# EAGLE design BPC3010_Papilio_Pro (EAGLE 5.11)
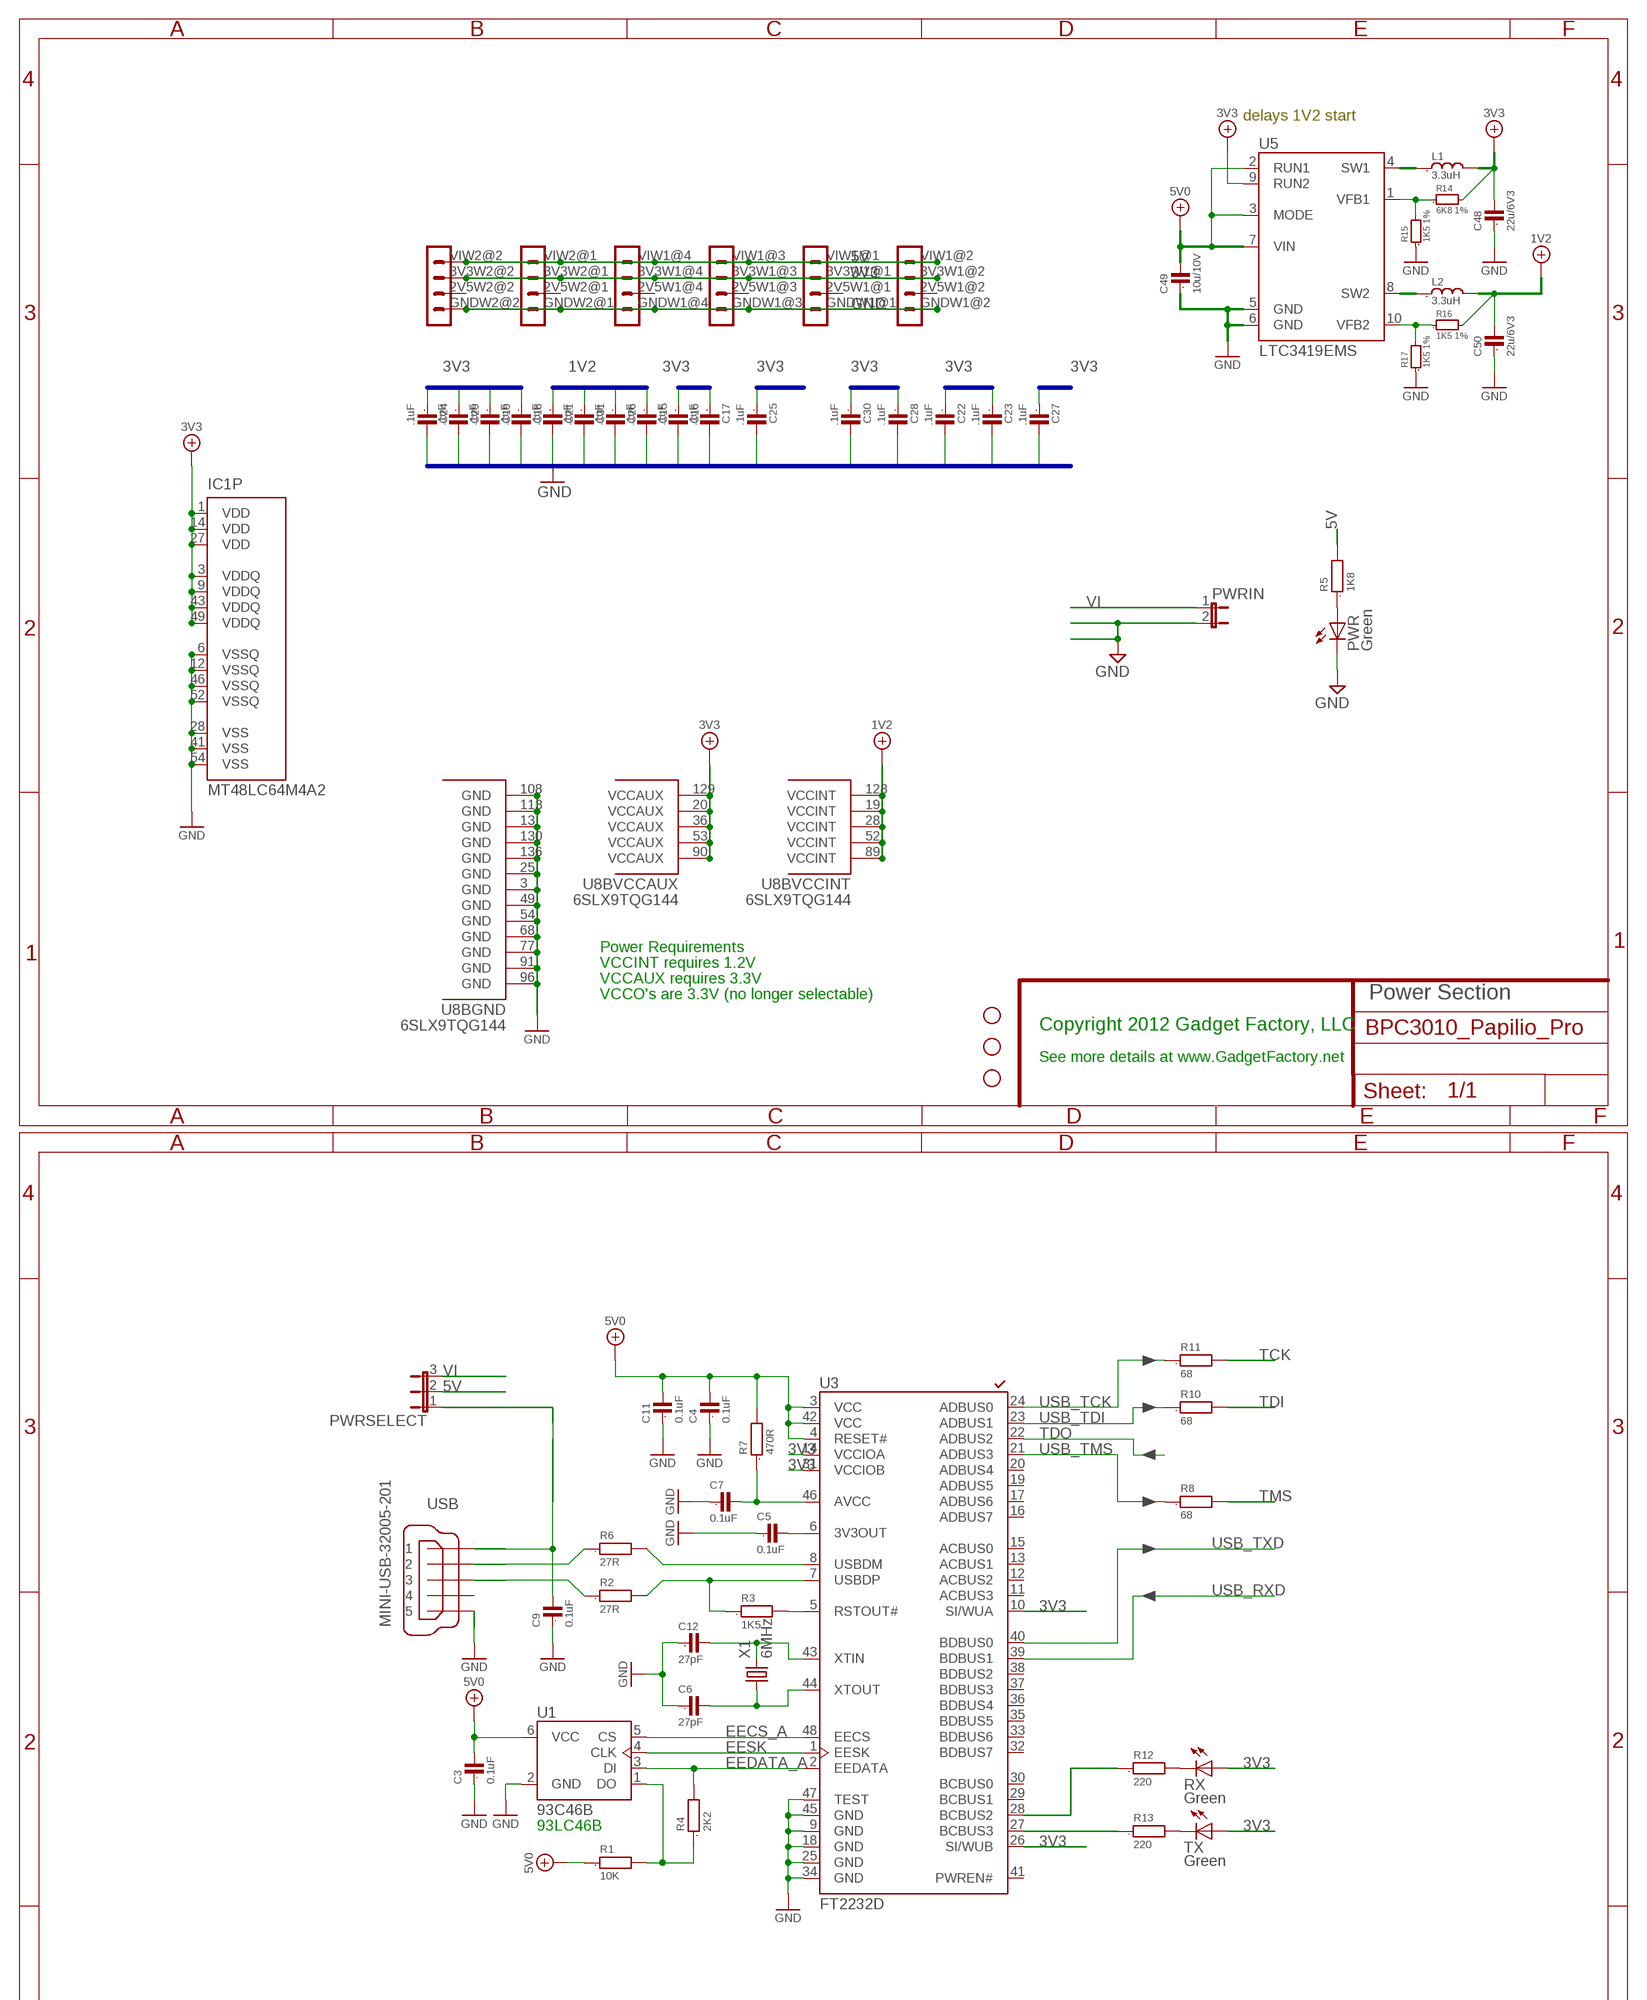
[diagram p0: schematic, sheet 1, part 1 of 2]
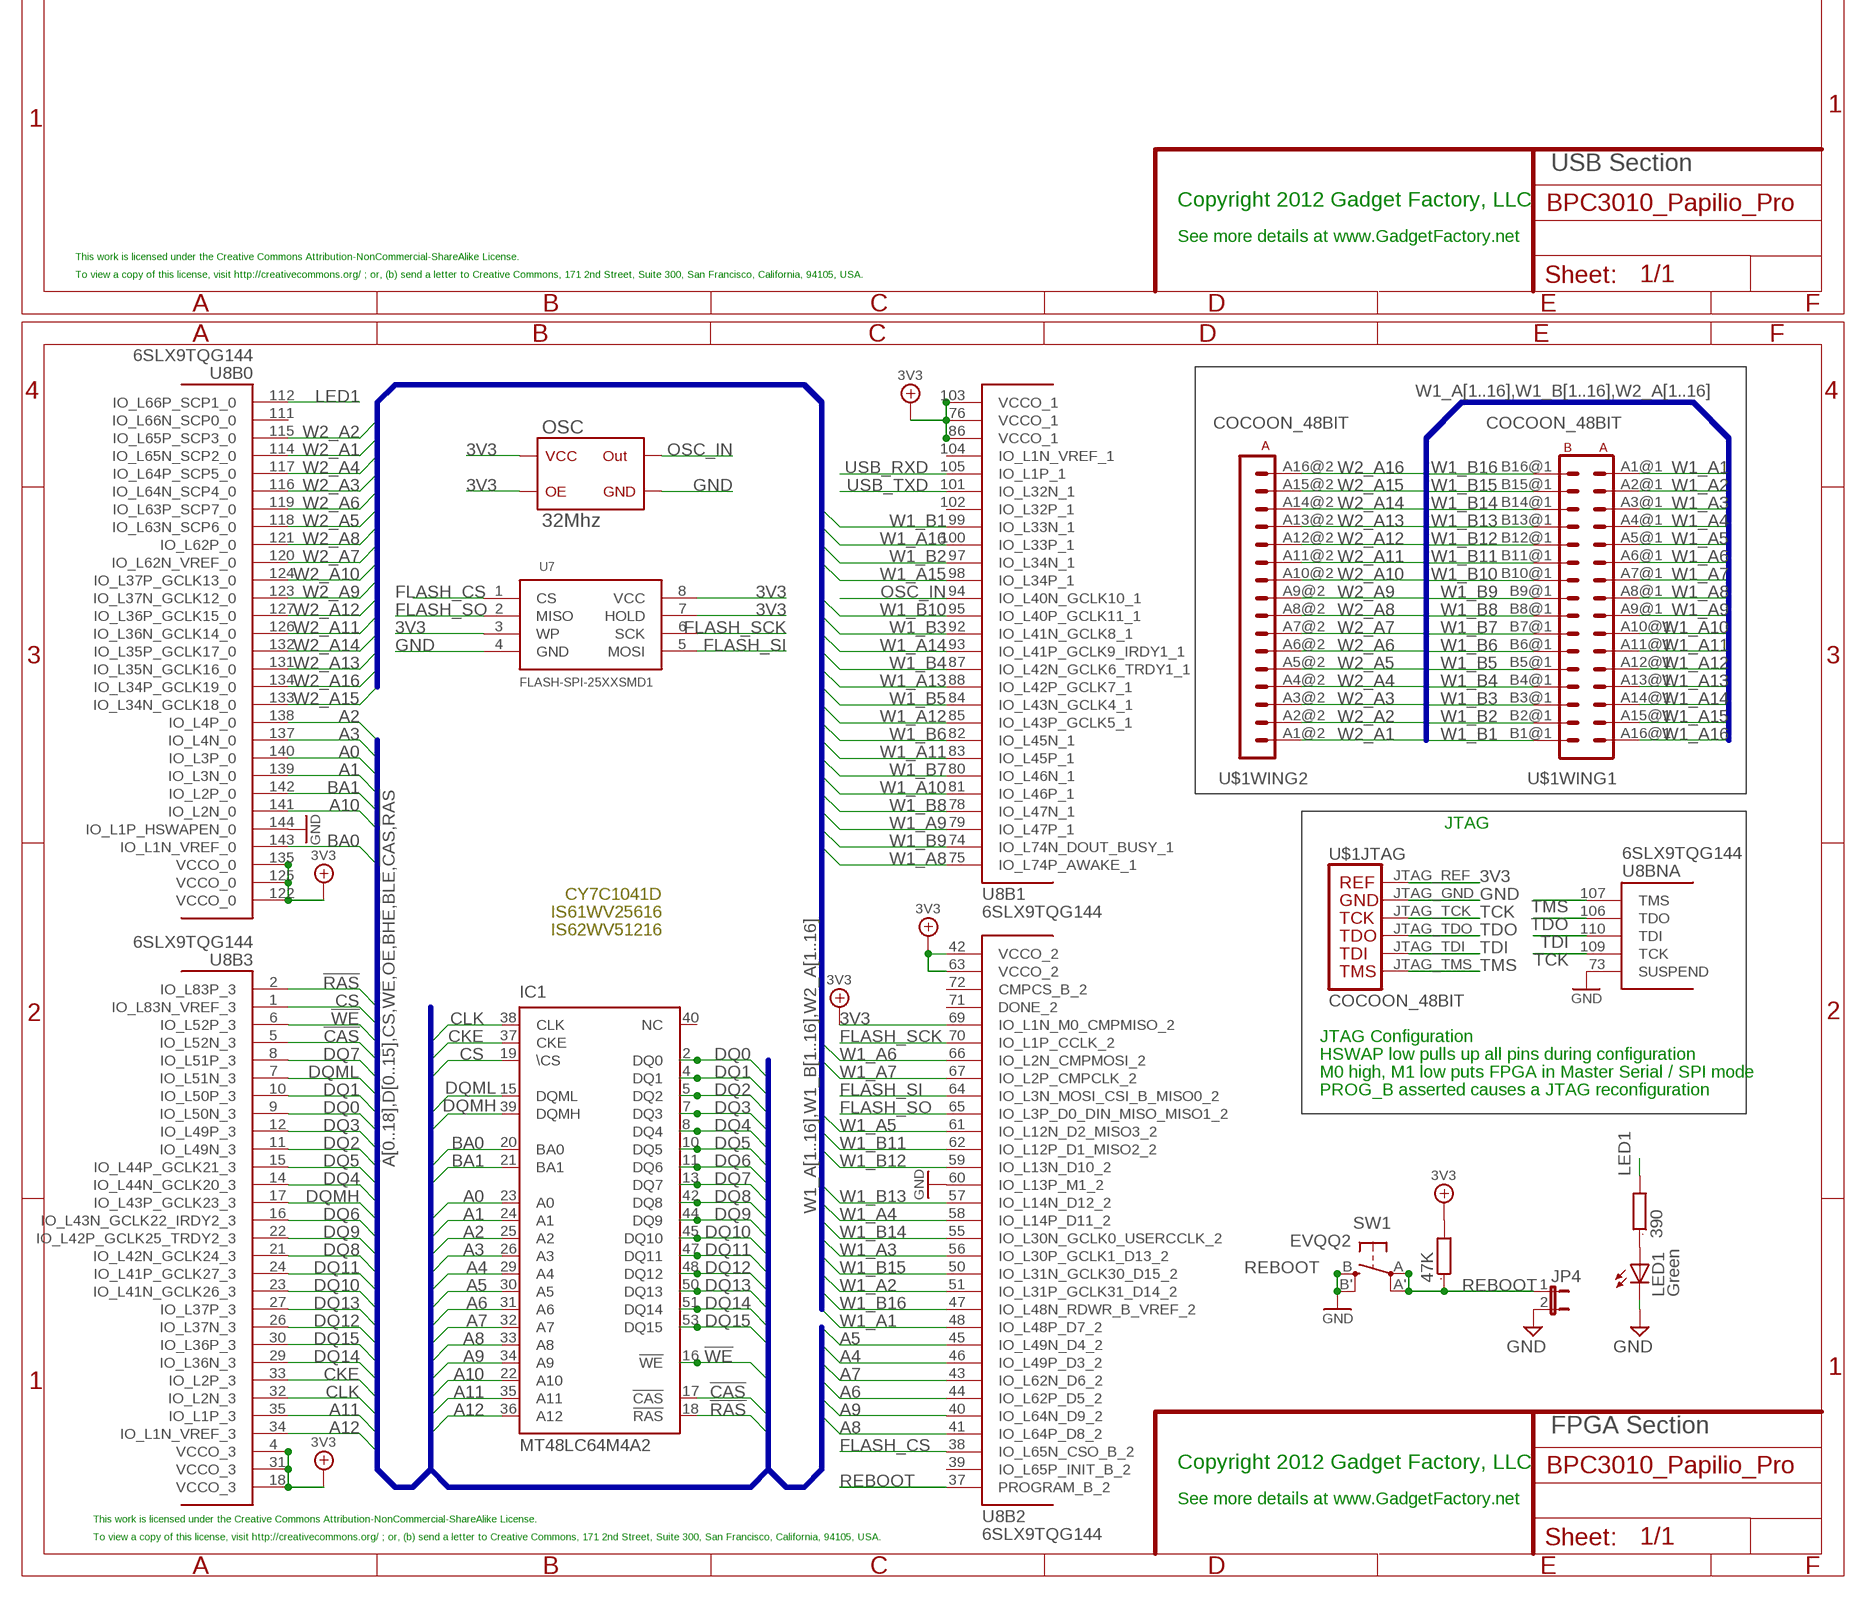
[diagram p1: schematic, sheet 1, part 2 of 2]

## Parts
C3  0.1uF  C0805  [0805]
C4  0.1uF  C0805  [0805]
C5  0.1uF  C0805  [0805]
C6  27pF  C0805  [0805]
C7  0.1uF  C0805  [0805]
C9  0.1uF  C0805  [0805]
C11  0.1uF  C0805  [0805]
C12  27pF  C0805  [0805]
C15  .1uF  C0603  [0603]
C16  .1uF  C0603  [0603]
C17  .1uF  C0603  [0603]
C18  .1uF  C0603  [0603]
C19  .1uF  C0603  [0603]
C21  .1uF  C0603  [0603]
C22  .1uF  C0603  [0603]
C23  .1uF  C0603  [0603]
C24  .1uF  C0603  [0603]
C25  .1uF  C0603  [0603]
C26  .1uF  C0603  [0603]
C27  .1uF  C0603  [0603]
C28  .1uF  C0603  [0603]
C29  .1uF  C0603  [0603]
C30  .1uF  C0603  [0603]
C31  .1uF  C0603  [0603]
C48  22u/6V3  C0805  [0805]
C49  10u/10V  C0805  [0805]
C50  22u/6V3  C0805  [0805]
IC1  MT48LC64M4A2  [TSOP54-400]
JP2  STAND-OFF  [STAND-OFF]
JP3  STAND-OFF  [STAND-OFF]
JP4  JP1E  [JP1]
JP5  STAND-OFF  [STAND-OFF]
L1  3.3uH  L_VLS3015  [VLS3015]
L2  3.3uH  L_VLS3015  [VLS3015]
LED1  Green  LEDCHIPLED_0805  [CHIPLED_0805]
OSC  32Mhz  OSC1  [OSC1]
PWR  Green  LEDCHIP-LED0805  [CHIP-LED0805]
PWRIN  JP1E  [JP1]
PWRSELECT  JP2E  [JP2]
R1  10K  R0805  [0805@1]
R2  27R  R0805  [0805@1]
R3  1K5  R0805  [0805@1]
R4  2K2  R0805  [0805@1]
R5  1K8  R0805  [0805]
R6  27R  R0805  [0805@1]
R7  470R  R0805  [0805@1]
R8  68  R0805  [0805]
R10  68  R0805  [0805]
R11  68  R0805  [0805]
R12  220  R0805  [0805]
R13  220  R0805  [0805]
R14  6K8 1%  R-SMALL0603  [0603]
R15  1K5 1%  R-SMALL0603  [0603]
R16  1K5 1%  R-SMALL0603  [0603]
R17  1K5 1%  R-SMALL0603  [0603]
R33  47K  R0805  [0805]
R37  390  R0805  [0805]
RX  Green  LEDCHIP-LED0805  [CHIP-LED0805]
SW1  EVQQ2  [EVQ-Q2]
TX  Green  LEDCHIP-LED0805  [CHIP-LED0805]
U1  93C46B  DIGITAL-EEPROM-MICROWIRE-6P_SOT23  [SOT23-6]
U3  FT2232D  [LQFP48]
U5  LTC3419EMS  [MSOP10]
U7  FLASH-SPI-25XXSMD1  [SO08-EIAJ]
U8  6SLX9TQG144  [TQ144]
U$1  COCOON_48BIT  [COCOON_48BIT]
USB  MINI-USB-32005-201  [32005-201]
X1  6MHz  CRYSTALHC49S  [HC49/S]

## Nets
1V2: C15.1 C21.1 C26.1 C31.1 C50.2 L2.2 R16.2 U8.19(BVCCINT:VCCINT) U8.28(BVCCINT:VCCINT) U8.52(BVCCINT:VCCINT) U8.89(BVCCINT:VCCINT) U8.128(BVCCINT:VCCINT)
3V3: C16.1 C17.1 C18.1 C19.1 C22.1 C23.1 C24.1 C25.1 C27.1 C28.1 C29.1 C30.1 C48.2 IC1.1(VDD) IC1.3(VDDQ) IC1.9(VDDQ) IC1.14(VDD) IC1.27(VDD) IC1.43(VDDQ) IC1.49(VDDQ) L1.2 OSC.1@1(OE) OSC.4@4(VCC) R14.2 R33.2 RX.A TX.A U3.10(SI/WUA) U3.14(VCCIOA) U3.26(SI/WUB) U3.31(VCCIOB) U5.9(RUN2) U7.3(WP) U7.7(HOLD) U7.8(VCC) U8.4(B3:VCCO_3) U8.18(B3:VCCO_3) U8.20(BVCCAUX:VCCAUX) U8.31(B3:VCCO_3) U8.36(BVCCAUX:VCCAUX) U8.42(B2:VCCO_2) U8.53(BVCCAUX:VCCAUX) U8.63(B2:VCCO_2) U8.69(B2:IO_L1N_M0_CMPMISO_2) U8.76(B1:VCCO_1) U8.86(B1:VCCO_1) U8.90(BVCCAUX:VCCAUX) U8.103(B1:VCCO_1) U8.122(B0:VCCO_0) U8.125(B0:VCCO_0) U8.129(BVCCAUX:VCCAUX) U8.135(B0:VCCO_0) U$1.3V3W1@1(3V3) U$1.3V3W1@2(3V3) U$1.3V3W1@3(3V3) U$1.3V3W1@4(3V3) U$1.3V3W2@1(3V3) U$1.3V3W2@2(3V3) U$1.JTAG_REF(JTAG:JTAG_REF)
3V3OUT_A: C5.2 U3.6(3V3OUT)
5V: C3.2 C4.2 C11.2 C49.2 PWRSELECT.2 R1.1 R5.2 R7.2 U1.6(VCC) U3.3(VCC) U3.4(RESET#) U3.42(VCC) U5.2(RUN1) U5.3(MODE) U5.7(VIN) U$1.VIW1@1(5V) U$1.VIW1@2(5V) U$1.VIW1@3(5V) U$1.VIW1@4(5V) U$1.VIW2@1(5V) U$1.VIW2@2(5V) ; supply symbol labelled 5V0
!CAS: IC1.17(!CAS) U8.5(B3:IO_L52N_3)
!RAS: IC1.18(!RAS) U8.2(B3:IO_L83P_3)
!WE: IC1.16(!WE) U8.6(B3:IO_L52P_3)
A0: IC1.23(A0) U8.140(B0:IO_L3P_0)
A1: IC1.24(A1) U8.139(B0:IO_L3N_0)
A2: IC1.25(A2) U8.138(B0:IO_L4P_0)
A3: IC1.26(A3) U8.137(B0:IO_L4N_0)
A4: IC1.29(A4) U8.46(B2:IO_L49P_D3_2)
A5: IC1.30(A5) U8.45(B2:IO_L49N_D4_2)
A6: IC1.31(A6) U8.44(B2:IO_L62P_D5_2)
A7: IC1.32(A7) U8.43(B2:IO_L62N_D6_2)
A8: IC1.33(A8) U8.41(B2:IO_L64P_D8_2)
A9: IC1.34(A9) U8.40(B2:IO_L64N_D9_2)
A10: IC1.22(A10) U8.141(B0:IO_L2N_0)
A11: IC1.35(A11) U8.35(B3:IO_L1P_3)
A12: IC1.36(A12) U8.34(B3:IO_L1N_VREF_3)
BA0: IC1.20(BA0) U8.143(B0:IO_L1N_VREF_0)
BA1: IC1.21(BA1) U8.142(B0:IO_L2P_0)
CKE: IC1.37(CKE) U8.33(B3:IO_L2P_3)
CLK: IC1.38(CLK) U8.32(B3:IO_L2N_3)
CS: IC1.19(\CS) U8.1(B3:IO_L83N_VREF_3)
D+: R2.1 USB.3
D-: R6.1 USB.2
DO_A: R1.2 R4.1 U1.1(DO)
DQ0: IC1.2(DQ0) U8.9(B3:IO_L50N_3)
DQ1: IC1.4(DQ1) U8.10(B3:IO_L50P_3)
DQ2: IC1.5(DQ2) U8.11(B3:IO_L49N_3)
DQ3: IC1.7(DQ3) U8.12(B3:IO_L49P_3)
DQ4: IC1.8(DQ4) U8.14(B3:IO_L44N_GCLK20_3)
DQ5: IC1.10(DQ5) U8.15(B3:IO_L44P_GCLK21_3)
DQ6: IC1.11(DQ6) U8.16(B3:IO_L43N_GCLK22_IRDY2_3)
DQ7: IC1.13(DQ7) U8.8(B3:IO_L51P_3)
DQ8: IC1.42(DQ8) U8.21(B3:IO_L42N_GCLK24_3)
DQ9: IC1.44(DQ9) U8.22(B3:IO_L42P_GCLK25_TRDY2_3)
DQ10: IC1.45(DQ10) U8.23(B3:IO_L41N_GCLK26_3)
DQ11: IC1.47(DQ11) U8.24(B3:IO_L41P_GCLK27_3)
DQ12: IC1.48(DQ12) U8.26(B3:IO_L37N_3)
DQ13: IC1.50(DQ13) U8.27(B3:IO_L37P_3)
DQ14: IC1.51(DQ14) U8.29(B3:IO_L36N_3)
DQ15: IC1.53(DQ15) U8.30(B3:IO_L36P_3)
DQMH: IC1.39(DQMH) U8.17(B3:IO_L43P_GCLK23_3)
DQML: IC1.15(DQML) U8.7(B3:IO_L51N_3)
EECS_A: U1.5(CS) U3.48(EECS)
EEDATA_A: R4.2 U1.3(DI) U3.2(EEDATA)
EESK: U1.4(CLK) U3.1(EESK)
FB_1V2: R16.1 R17.2 U5.10(VFB2)
FB_3V3: R14.1 R15.2 U5.1(VFB1)
FILTERED_VCC_A: C7.2 R7.1 U3.46(AVCC)
FLASH_CS: U7.1(CS) U8.38(B2:IO_L65N_CSO_B_2)
FLASH_SCK: U7.6(SCK) U8.70(B2:IO_L1P_CCLK_2)
FLASH_SI: U7.5(MOSI) U8.64(B2:IO_L3N_MOSI_CSI_B_MISO0_2)
FLASH_SO: U7.2(MISO) U8.65(B2:IO_L3P_D0_DIN_MISO_MISO1_2)
GND: C3.1 C4.1 C5.1 C6.1 C7.1 C9.1 C11.1 C12.1 C15.2 C16.2 C17.2 C18.2 C19.2 C21.2 C22.2 C23.2 C24.2 C25.2 C26.2 C27.2 C28.2 C29.2 C30.2 C31.2 C48.1 C49.1 C50.1 IC1.6(VSSQ) IC1.12(VSSQ) IC1.28(VSS) IC1.41(VSS) IC1.46(VSSQ) IC1.52(VSSQ) IC1.54(VSS) JP4.2 LED1.C OSC.2@2(GND) PWR.C PWRIN.2 R15.1 R17.1 SW1.B'(S1) SW1.B(S) U1.2(GND) U3.9(GND) U3.18(GND) U3.25(GND) U3.34(GND) U3.45(GND) U3.47(TEST) U5.5(GND) U5.6(GND) U7.4(GND) U8.3(BGND:GND) U8.13(BGND:GND) U8.25(BGND:GND) U8.49(BGND:GND) U8.54(BGND:GND) U8.60(B2:IO_L13P_M1_2) U8.68(BGND:GND) U8.73(BNA:SUSPEND) U8.77(BGND:GND) U8.91(BGND:GND) U8.96(BGND:GND) U8.108(BGND:GND) U8.113(BGND:GND) U8.130(BGND:GND) U8.136(BGND:GND) U8.144(B0:IO_L1P_HSWAPEN_0) U$1.GNDW1@1(GND) U$1.GNDW1@2(GND) U$1.GNDW1@3(GND) U$1.GNDW1@4(GND) U$1.GNDW2@1(GND) U$1.GNDW2@2(GND) U$1.JTAG_GND(JTAG:JTAG_GND) USB.5
LED1: R37.2 U8.112(B0:IO_L66P_SCP1_0)
N$1: PWR.A R5.1
N$2: R12.2 RX.C
N$3: R13.2 TX.C
N$4: R13.1 U3.27(BCBUS3)
N$5: R12.1 U3.28(BCBUS2)
N$7: LED1.A R37.1
N$15_A: R3.2 U3.5(RSTOUT#)
OSC_IN: OSC.3@3(OUT) U8.94(B1:IO_L40N_GCLK10_1)
REBOOT: JP4.1 R33.1 SW1.A'(P1) SW1.A(P) U8.37(B2:PROGRAM_B_2)
SW_1V2: L2.1 U5.8(SW2)
SW_3V3: L1.1 U5.4(SW1)
TCK: R11.2 U8.109(BNA:TCK) U$1.JTAG_TCK(JTAG:JTAG_TCK)
TDI: R10.2 U8.110(BNA:TDI) U$1.JTAG_TDI(JTAG:JTAG_TDI)
TDO: U3.22(ADBUS2) U8.106(BNA:TDO) U$1.JTAG_TDO(JTAG:JTAG_TDO)
TMS: R8.2 U8.107(BNA:TMS) U$1.JTAG_TMS(JTAG:JTAG_TMS)
USB_RXD: U3.39(BDBUS1) U8.105(B1:IO_L1P_1)
USB_TCK: R11.1 U3.24(ADBUS0)
USB_TDI: R10.1 U3.23(ADBUS1)
USB_TMS: R8.1 U3.21(ADBUS3)
USB_TXD: U3.40(BDBUS0) U8.101(B1:IO_L32N_1)
USBDM_A: R6.2 U3.8(USBDM)
USBDP_A: R2.2 R3.1 U3.7(USBDP)
VBUS_A: C9.2 PWRSELECT.1 USB.1
VI: PWRIN.1 PWRSELECT.3
W1_A1: U8.48(B2:IO_L48P_D7_2) U$1.A1@1(WING1:A1)
W1_A2: U8.51(B2:IO_L31P_GCLK31_D14_2) U$1.A2@1(WING1:A2)
W1_A3: U8.56(B2:IO_L30P_GCLK1_D13_2) U$1.A3@1(WING1:A3)
W1_A4: U8.58(B2:IO_L14P_D11_2) U$1.A4@1(WING1:A4)
W1_A5: U8.61(B2:IO_L12N_D2_MISO3_2) U$1.A5@1(WING1:A5)
W1_A6: U8.66(B2:IO_L2N_CMPMOSI_2) U$1.A6@1(WING1:A6)
W1_A7: U8.67(B2:IO_L2P_CMPCLK_2) U$1.A7@1(WING1:A7)
W1_A8: U8.75(B1:IO_L74P_AWAKE_1) U$1.A8@1(WING1:A8)
W1_A9: U8.79(B1:IO_L47P_1) U$1.A9@1(WING1:A9)
W1_A10: U8.81(B1:IO_L46P_1) U$1.A10@1(WING1:A10)
W1_A11: U8.83(B1:IO_L45P_1) U$1.A11@1(WING1:A11)
W1_A12: U8.85(B1:IO_L43P_GCLK5_1) U$1.A12@1(WING1:A12)
W1_A13: U8.88(B1:IO_L42P_GCLK7_1) U$1.A13@1(WING1:A13)
W1_A14: U8.93(B1:IO_L41P_GCLK9_IRDY1_1) U$1.A14@1(WING1:A14)
W1_A15: U8.98(B1:IO_L34P_1) U$1.A15@1(WING1:A15)
W1_A16: U8.100(B1:IO_L33P_1) U$1.A16@1(WING1:A16)
W1_B1: U8.99(B1:IO_L33N_1) U$1.B1@1(WING1:B1)
W1_B2: U8.97(B1:IO_L34N_1) U$1.B2@1(WING1:B2)
W1_B3: U8.92(B1:IO_L41N_GCLK8_1) U$1.B3@1(WING1:B3)
W1_B4: U8.87(B1:IO_L42N_GCLK6_TRDY1_1) U$1.B4@1(WING1:B4)
W1_B5: U8.84(B1:IO_L43N_GCLK4_1) U$1.B5@1(WING1:B5)
W1_B6: U8.82(B1:IO_L45N_1) U$1.B6@1(WING1:B6)
W1_B7: U8.80(B1:IO_L46N_1) U$1.B7@1(WING1:B7)
W1_B8: U8.78(B1:IO_L47N_1) U$1.B8@1(WING1:B8)
W1_B9: U8.74(B1:IO_L74N_DOUT_BUSY_1) U$1.B9@1(WING1:B9)
W1_B10: U8.95(B1:IO_L40P_GCLK11_1) U$1.B10@1(WING1:B10)
W1_B11: U8.62(B2:IO_L12P_D1_MISO2_2) U$1.B11@1(WING1:B11)
W1_B12: U8.59(B2:IO_L13N_D10_2) U$1.B12@1(WING1:B12)
W1_B13: U8.57(B2:IO_L14N_D12_2) U$1.B13@1(WING1:B13)
W1_B14: U8.55(B2:IO_L30N_GCLK0_USERCCLK_2) U$1.B14@1(WING1:B14)
W1_B15: U8.50(B2:IO_L31N_GCLK30_D15_2) U$1.B15@1(WING1:B15)
W1_B16: U8.47(B2:IO_L48N_RDWR_B_VREF_2) U$1.B16@1(WING1:B16)
W2_A1: U8.114(B0:IO_L65N_SCP2_0) U$1.A1@2(WING2:A1)
W2_A2: U8.115(B0:IO_L65P_SCP3_0) U$1.A2@2(WING2:A2)
W2_A3: U8.116(B0:IO_L64N_SCP4_0) U$1.A3@2(WING2:A3)
W2_A4: U8.117(B0:IO_L64P_SCP5_0) U$1.A4@2(WING2:A4)
W2_A5: U8.118(B0:IO_L63N_SCP6_0) U$1.A5@2(WING2:A5)
W2_A6: U8.119(B0:IO_L63P_SCP7_0) U$1.A6@2(WING2:A6)
W2_A7: U8.120(B0:IO_L62N_VREF_0) U$1.A7@2(WING2:A7)
W2_A8: U8.121(B0:IO_L62P_0) U$1.A8@2(WING2:A8)
W2_A9: U8.123(B0:IO_L37N_GCLK12_0) U$1.A9@2(WING2:A9)
W2_A10: U8.124(B0:IO_L37P_GCLK13_0) U$1.A10@2(WING2:A10)
W2_A11: U8.126(B0:IO_L36N_GCLK14_0) U$1.A11@2(WING2:A11)
W2_A12: U8.127(B0:IO_L36P_GCLK15_0) U$1.A12@2(WING2:A12)
W2_A13: U8.131(B0:IO_L35N_GCLK16_0) U$1.A13@2(WING2:A13)
W2_A14: U8.132(B0:IO_L35P_GCLK17_0) U$1.A14@2(WING2:A14)
W2_A15: U8.133(B0:IO_L34N_GCLK18_0) U$1.A15@2(WING2:A15)
W2_A16: U8.134(B0:IO_L34P_GCLK19_0) U$1.A16@2(WING2:A16)
XTIN_A: C12.2 U3.43(XTIN) X1.2
XTOUT_A: C6.2 U3.44(XTOUT) X1.1
Unconnected: IC1.40(NC) U3.11(ACBUS3) U3.12(ACBUS2) U3.13(ACBUS1) U3.15(ACBUS0) U3.16(ADBUS7) U3.17(ADBUS6) U3.19(ADBUS5) U3.20(ADBUS4) U3.29(BCBUS1) U3.30(BCBUS0) U3.32(BDBUS7) U3.33(BDBUS6) U3.35(BDBUS5) U3.36(BDBUS4) U3.37(BDBUS3) U3.38(BDBUS2) U3.41(PWREN#) U8.39(B2:IO_L65P_INIT_B_2) U8.71(B2:DONE_2) U8.72(B2:CMPCS_B_2) U8.102(B1:IO_L32P_1) U8.104(B1:IO_L1N_VREF_1) U8.111(B0:IO_L66N_SCP0_0) U$1.2V5W1@1(2V5) U$1.2V5W1@2(2V5) U$1.2V5W1@3(2V5) U$1.2V5W1@4(2V5) U$1.2V5W2@1(2V5) U$1.2V5W2@2(2V5) USB.4

## Buses
GND
1V2
W1_A[1..16],W1_B[1..16],W2_A[1..16]
3V3
A[0..18],D[0..15],CS,WE,OE,BHE,BLE,!CAS,!RAS

## Notes on the sheet
- delays 1V2 start
- Power Requirements
- VCCINT requires 1.2V
- VCCAUX requires 3.3V
- VCCO's are 3.3V (no longer selectable) | Power Section
- Copyright 2012 Gadget Factory, LLC
- See more details at www.GadgetFactory.net
- 93LC46B
- USB Section
- Copyright 2012 Gadget Factory, LLC
- See more details at www.GadgetFactory.net
- This work is licensed under the Creative Commons Attribution-NonCommercial-ShareAlike License.
- To view a copy of this license, visit http://creativecommons.org/ ; or, (b) send a letter to Creative Commons, 171 2nd Street, Suite 300, San Francisco, California, 94105, USA.
- JTAG
- CY7C1041D
- IS61WV25616
- IS62WV51216
- JTAG Configuration
- HSWAP low pulls up all pins during configuration
- M0 high, M1 low puts FPGA in Master Serial / SPI mode
- PROG_B asserted causes a JTAG reconfiguration
- REBOOT
- FPGA Section
- Copyright 2012 Gadget Factory, LLC
- See more details at www.GadgetFactory.net
- This work is licensed under the Creative Commons Attribution-NonCommercial-ShareAlike License.
- To view a copy of this license, visit http://creativecommons.org/ ; or, (b) send a letter to Creative Commons, 171 2nd Street, Suite 300, San Francisco, California, 94105, USA.

## Library data of the parts
C3-C7 C9 C11 C12 C48-C50 = Bogdan_Commons:C: CAPACITOR, European symbol
C15-C19 C21-C31 = GadgetFactory:C: CAPACITOR, European symbol
IC1 = memory-micron:MT48LC64M4A2: 256Mb: x16 SDRAM MT48LC64M4A2 - 16 Meg x 4 x 4 banks Source: http://download.micron.com/pdf/datasheets/dram/sdram/256MSDRAM.pdf; OC_FARNELL: unknown; OC_NEWARK: unknown
JP2 JP3 JP5 = GadgetFactory_Pub - Copy:STAND-OFF: Stand Off This is the mechanical footprint for a #4 phillips button head screw. Use the keepout ring to avoid running the screw head into surrounding components. SKU : PRT-00447
JP4 PWRIN = jumper:JP1E: JUMPER
L1 L2 = Bogdan_Commons:L: INDUCTOR, European symbol
LED1 PWR RX TX = led:LED: LED OSRAM: - CHIPLED LG R971, LG N971, LY N971, LG Q971, LY Q971, LO R971, LY R971 LH N974, LH R974 LS Q976, LO Q976, LY Q976 LO Q996 - Hyper CHIPLED LW Q18S LB Q993, LB Q99A, LB R99A - SideLED LS A670, LO A670, LY A670, LG A670, LP A670 LB A673, LV A673, LT A673, LW A673 LH A674 LY A675 LS A676, LA A676, LO A676, LY A676, LW A676 LS A679, LY A679, LG A679 - Hyper Micro SIDELED® LS Y876, LA Y876, LO Y876, LY Y876 LT Y87S - SmartLED LW L88C, LW L88S LB L89C, LB L89S, LG L890 LS L89K, LO L89K, LY L89K LS L896, LA L896, LO L896, LY L896 - TOPLED LS T670, LO T670, LY T670, LG T670, LP T670 LSG T670, LSP T670, LSY T670, LOP T670, LYG T670 LG T671, LOG T671, LSG T671 LB T673, LV T673, LT T673, LW T673 LH T674 LS T676, LA T676, LO T676, LY T676, LB T676, LH T676, LSB T676, LW T676 LB T67C, LV T67C, LT T67C, LS T67K, LO T67K, LY T67K, LW E67C LS E67B, LA E67B, LO E67B, LY E67B, LB E67C, LV E67C, LT E67C LW T67C LS T679, LY T679, LG T679 LS T770, LO T770, LY T770, LG T770, LP T770 LB T773, LV T773, LT T773, LW T773 LH T774 LS E675, LA E675, LY E675, LS T675 LS T776, LA T776, LO T776, LY T776, LB T776 LHGB T686 LT T68C, LB T68C - Hyper Mini TOPLED® LB M676 - Mini TOPLED Santana® LG M470 LS M47K, LO M47K, LY M47K Source: http://www.osram.convergy.de LUXEON: - LUMILED® LXK2-PW12-R00, LXK2-PW12-S00, LXK2-PW14-U00, LXK2-PW14-V00 LXK2-PM12-R00, LXK2-PM12-S00, LXK2-PM14-U00 LXK2-PE12-Q00, LXK2-PE12-R00, LXK2-PE12-S00, LXK2-PE14-T00, LXK2-PE14-U00 LXK2-PB12-K00, LXK2-PB12-L00, LXK2-PB12-M00, LXK2-PB14-N00, LXK2-PB14-P00, LXK2-PB14-Q00 LXK2-PR12-L00, LXK2-PR12-M00, LXK2-PR14-Q00, LXK2-PR14-R00 LXK2-PD12-Q00, LXK2-PD12-R00, LXK2-PD12-S00 LXK2-PH12-R00, LXK2-PH12-S00 LXK2-PL12-P00, LXK2-PL12-Q00, LXK2-PL12-R00 Source: www.luxeon.com KINGBRIGHT: KA-3528ASYC Source: www.kingbright.com
OSC = MondoCPLDCore-XC95_Rev1.5:OSC1
PWRSELECT = jumper:JP2E: JUMPER
R1-R4 R6 R7 = Bogdan_Commons:R: RESISTOR, European symbol
R5 R8 R10-R13 R33 R37 = GadgetFactory:R: RESISTOR, European symbol
R14-R17 = Bogdan_Commons:R-SMALL
SW1 = adafruit:EVQQ2: SMT 6mm switch, EVQQ2 series http://www.ladyada.net/library/eagle
U1 = Bogdan_Commons:DIGITAL-EEPROM-MICROWIRE-6P
U3 = Bogdan_Commons:FT2232D
U5 = Bogdan_Commons:LTC3419: Dual Monolithic 600mA Synchronous Step-Down Regulator
U7 = GadgetFactory:FLASH-SPI-25XX: SPI Flash
U8 = xilinx_devices:6SLX9TQG144: Xilinx FPGA: 6SLX9TQG144
U$1 = GadgetFactory_Pub:COCOON_48BIT
USB = con-cypressindustries:MINI-USB-: MINI USB-B Conector Source: www.cypressindustries.com
X1 = crystal:CRYSTAL: CRYSTAL

## Net classes
0 default: width 0.178 mm, drill 0.381 mm, clearance 0.178 mm
1 Power: width 0.813 mm, drill 0.381 mm, clearance 0.178 mm

## Board
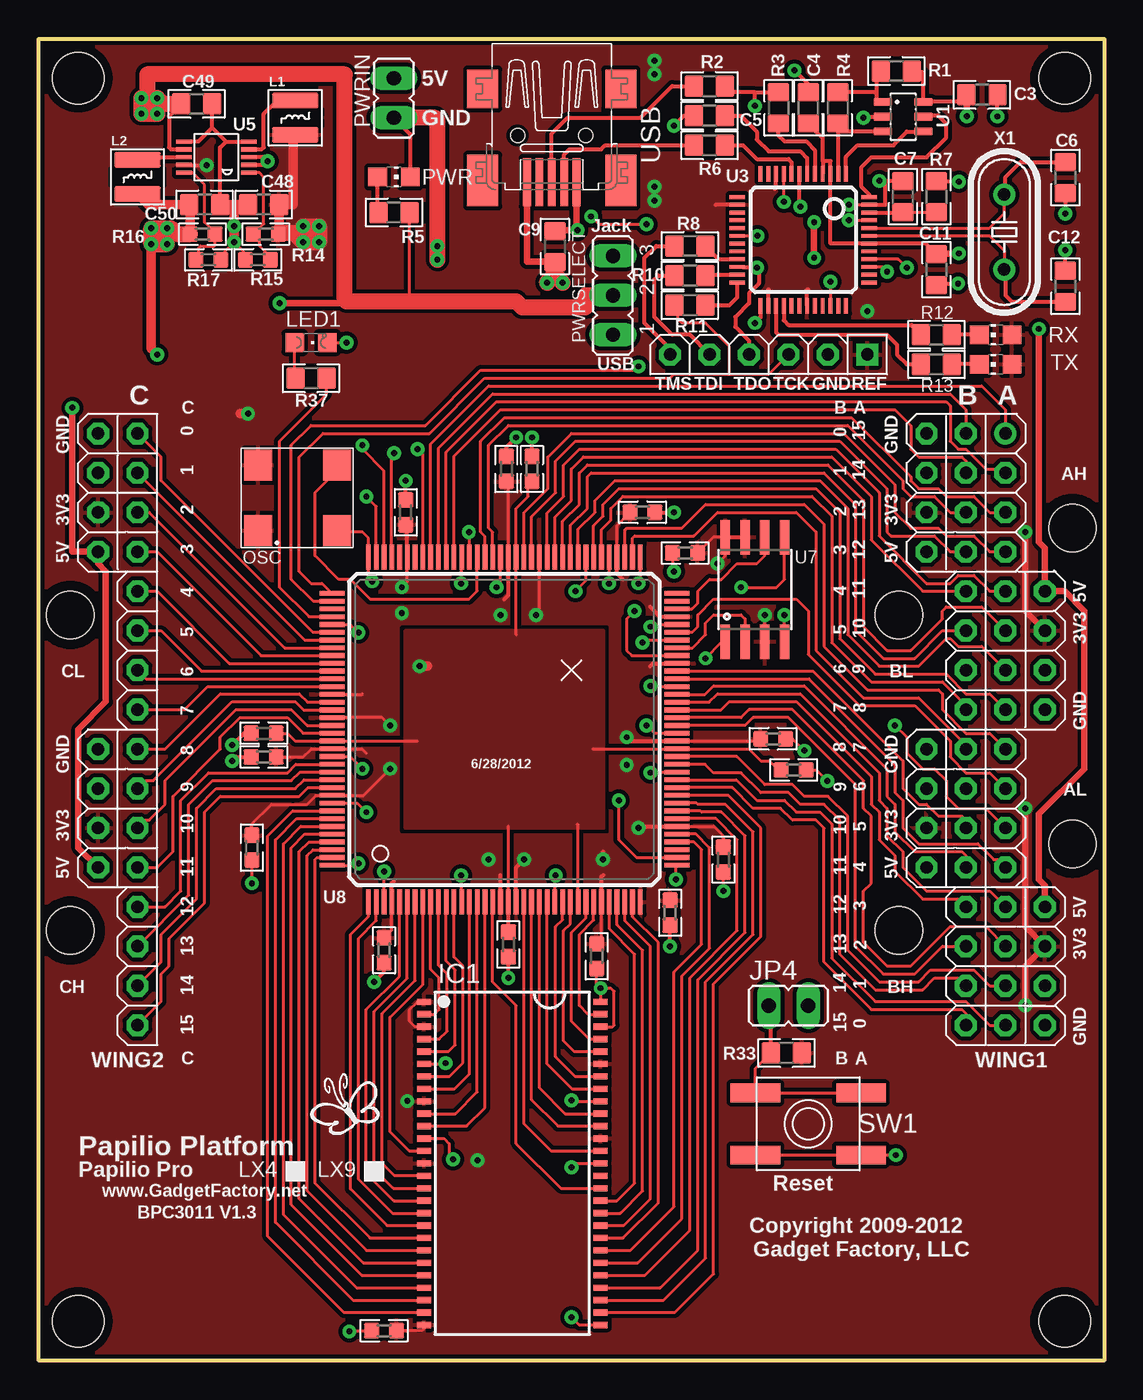
[diagram p2: board, top side]
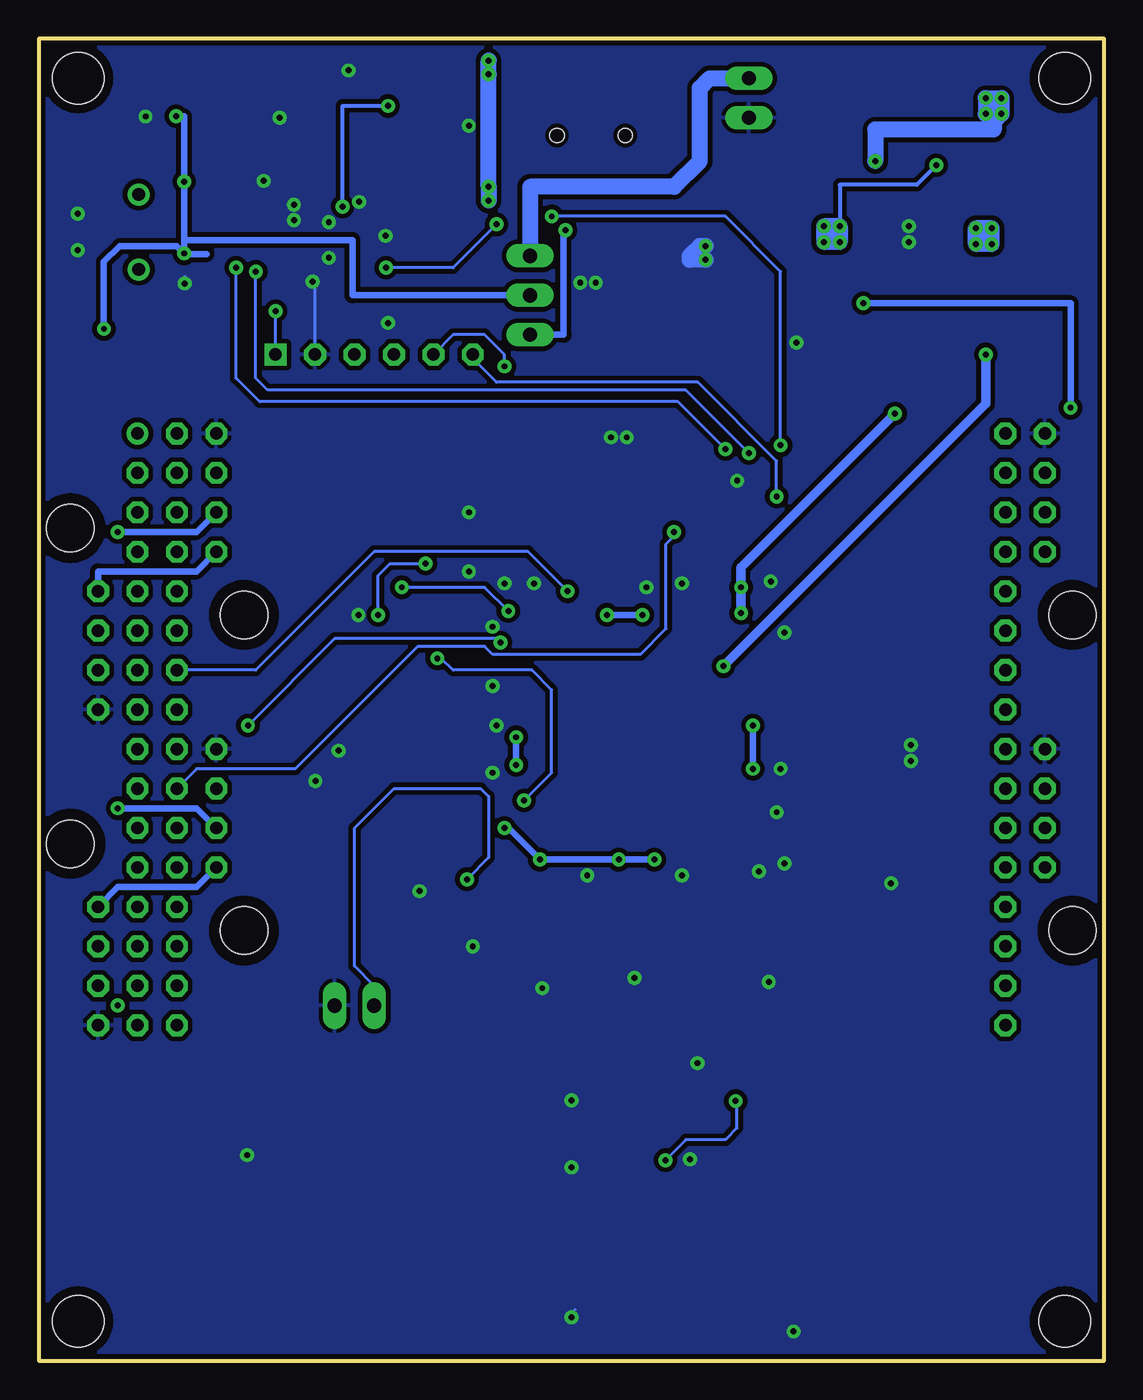
[diagram p3: board, bottom side, seen from below]

Size 68.58 x 85.09 mm. Coordinates in mm from the lower left corner, seen from the top.
Outline: 0,85.09 68.58,85.09 68.58,0 0,0 0,85.09
Copper layers (1*16): Top 0.035mm / dielectric 1.5mm / Bottom 0.035mm
Design rules "SparkFun_Derived_GoldePheonix_7mil *": minimum track width 7mil, minimum drill 15mil, track to track 7mil, track to pad 7mil, pad to pad 7mil, via to via 7mil, smd to smd 7mil, copper to edge 7mil, drill to drill 7mil, minimum pad ring 12mil, minimum via ring 10mil, stop-mask expansion 4mil, vias tented up to drill 18mil, thermal gap 10mil

### Footprints (pad centres in the part's own frame; a part is rotated, then mirrored left to right if it is on the bottom)
0805 = smd 1.2 x 1.4: 1 -1,0; 2 1,0
0603 = smd 1 x 1: 1 -0.8,0; 2 0.8,0
TSOP54-400 = smd 0.4 x 0.9: 1 -10.4,-5.68; 2 -9.6,-5.68; 3 -8.8,-5.68; 4 -8,-5.68; 5 -7.2,-5.68; 6 -6.4,-5.68; 7 -5.6,-5.68; 8 -4.8,-5.68; 9 -4,-5.68; 10 -3.2,-5.68; 11 -2.4,-5.68; 12 -1.6,-5.68; 13 -0.8,-5.68; 14 0,-5.68; 15 0.8,-5.68; 16 1.6,-5.68; 17 2.4,-5.68; 18 3.2,-5.68; 19 4,-5.68; 20 4.8,-5.68; 21 5.6,-5.68; 22 6.4,-5.68; 23 7.2,-5.68; 24 8,-5.68; 25 8.8,-5.68; 26 9.6,-5.68; 27 10.4,-5.68; 28 10.4,5.68; 29 9.6,5.68; 30 8.8,5.68; 31 8,5.68; 32 7.2,5.68; 33 6.4,5.68; 34 5.6,5.68; 35 4.8,5.68; 36 4,5.68; 37 3.2,5.68; 38 2.4,5.68; 39 1.6,5.68; 40 0.8,5.68; 41 0,5.68; 42 -0.8,5.68; 43 -1.6,5.68; 44 -2.4,5.68; 45 -3.2,5.68; 46 -4,5.68; 47 -4.8,5.68; 48 -5.6,5.68; 49 -6.4,5.68; 50 -7.2,5.68; 51 -8,5.68; 52 -8.8,5.68; 53 -9.6,5.68; 54 -10.4,5.68
STAND-OFF = hole 3.302: 0,0
JP1 = drill 0.914 long: 1 0,-1.27; 2 0,1.27
VLS3015 = smd 3 x 1: 1 0,1.1; 2 0,-1.1
CHIPLED_0805 = smd 1.2 x 1.2: A 0,-1.05; C 0,1.05
OSC1 = smd 1.8 x 2: 1@1 0,0; 2@2 5.08,0; 3@3 5.08,4.2; 4@4 0,4.2
CHIP-LED0805 = smd 1.2 x 1.2: A 0,-1.05; C 0,1.05
JP2 = drill 0.914 long: 1 -2.54,0; 2 0,0; 3 2.54,0
0805@1 = smd 1.2 x 1.4: 1 -1,0; 2 1,0
EVQ-Q2 = smd 3.2 x 1.2: A -3.4,-2; A' 3.4,-2; B -3.4,2; B' 3.4,2
SOT23-6 = smd 0.55 x 1.2: 1 -0.95,-1.3; 2 0,-1.3; 3 0.95,-1.3; 4 0.95,1.3; 5 0,1.3; 6 -0.95,1.3
LQFP48 = smd 0.25 x 1: 1 -2.75,-4.25; 2 -2.25,-4.25; 3 -1.75,-4.25; 4 -1.25,-4.25; 5 -0.75,-4.25; 6 -0.25,-4.25; 7 0.25,-4.25; 8 0.75,-4.25; 9 1.25,-4.25; 10 1.75,-4.25; 11 2.25,-4.25; 12 2.75,-4.25; 25 2.75,4.25; 26 2.25,4.25; 27 1.75,4.25; 28 1.25,4.25; 29 0.75,4.25; 30 0.25,4.25; 31 -0.25,4.25; 32 -0.75,4.25; 33 -1.25,4.25; 34 -1.75,4.25; 35 -2.25,4.25; 36 -2.75,4.25 | smd 1 x 0.25: 13 4.25,-2.75; 14 4.25,-2.25; 15 4.25,-1.75; 16 4.25,-1.25; 17 4.25,-0.75; 18 4.25,-0.25; 19 4.25,0.25; 20 4.25,0.75; 21 4.25,1.25; 22 4.25,1.75; 23 4.25,2.25; 24 4.25,2.75; 37 -4.25,2.75; 38 -4.25,2.25; 39 -4.25,1.75; 40 -4.25,1.25; 41 -4.25,0.75; 42 -4.25,0.25; 43 -4.25,-0.25; 44 -4.25,-0.75; 45 -4.25,-1.25; 46 -4.25,-1.75; 47 -4.25,-2.25; 48 -4.25,-2.75
MSOP10 = smd 0.28 x 1: 1 -1,-2.1; 2 -0.5,-2.1; 3 0,-2.1; 4 0.5,-2.1; 5 1,-2.1; 6 1,2.1; 7 0.5,2.1; 8 0,2.1; 9 -0.5,2.1; 10 -1,2.1
SO08-EIAJ = smd 0.61 x 2.21: 1 -1.905,-3.378; 2 -0.635,-3.378; 3 0.635,-3.378; 4 1.905,-3.378; 5 1.905,3.353; 6 0.635,3.353; 7 -0.635,3.353; 8 -1.905,3.353
TQ144 = smd 1.6 x 0.3: 1 -11.1,8.75; 2 -11.1,8.25; 3 -11.1,7.75; 4 -11.1,7.25; 5 -11.1,6.75; 6 -11.1,6.25; 7 -11.1,5.75; 8 -11.1,5.25; 9 -11.1,4.75; 10 -11.1,4.25; 11 -11.1,3.75; 12 -11.1,3.25; 13 -11.1,2.75; 14 -11.1,2.25; 15 -11.1,1.75; 16 -11.1,1.25; 17 -11.1,0.75; 18 -11.1,0.25; 19 -11.1,-0.25; 20 -11.1,-0.75; 21 -11.1,-1.25; 22 -11.1,-1.75; 23 -11.1,-2.25; 24 -11.1,-2.75; 25 -11.1,-3.25; 26 -11.1,-3.75; 27 -11.1,-4.25; 28 -11.1,-4.75; 29 -11.1,-5.25; 30 -11.1,-5.75; 31 -11.1,-6.25; 32 -11.1,-6.75; 33 -11.1,-7.25; 34 -11.1,-7.75; 35 -11.1,-8.25; 36 -11.1,-8.75; 73 11.1,-8.75; 74 11.1,-8.25; 75 11.1,-7.75; 76 11.1,-7.25; 77 11.1,-6.75; 78 11.1,-6.25; 79 11.1,-5.75; 80 11.1,-5.25; 81 11.1,-4.75; 82 11.1,-4.25; 83 11.1,-3.75; 84 11.1,-3.25; 85 11.1,-2.75; 86 11.1,-2.25; 87 11.1,-1.75; 88 11.1,-1.25; 89 11.1,-0.75; 90 11.1,-0.25; 91 11.1,0.25; 92 11.1,0.75; 93 11.1,1.25; 94 11.1,1.75; 95 11.1,2.25; 96 11.1,2.75; 97 11.1,3.25; 98 11.1,3.75; 99 11.1,4.25; 100 11.1,4.75; 101 11.1,5.25; 102 11.1,5.75; 103 11.1,6.25; 104 11.1,6.75; 105 11.1,7.25; 106 11.1,7.75; 107 11.1,8.25; 108 11.1,8.75 | smd 0.3 x 1.6: 37 -8.75,-11.1; 38 -8.25,-11.1; 39 -7.75,-11.1; 40 -7.25,-11.1; 41 -6.75,-11.1; 42 -6.25,-11.1; 43 -5.75,-11.1; 44 -5.25,-11.1; 45 -4.75,-11.1; 46 -4.25,-11.1; 47 -3.75,-11.1; 48 -3.25,-11.1; 49 -2.75,-11.1; 50 -2.25,-11.1; 51 -1.75,-11.1; 52 -1.25,-11.1; 53 -0.75,-11.1; 54 -0.25,-11.1; 55 0.25,-11.1; 56 0.75,-11.1; 57 1.25,-11.1; 58 1.75,-11.1; 59 2.25,-11.1; 60 2.75,-11.1; 61 3.25,-11.1; 62 3.75,-11.1; 63 4.25,-11.1; 64 4.75,-11.1; 65 5.25,-11.1; 66 5.75,-11.1; 67 6.25,-11.1; 68 6.75,-11.1; 69 7.25,-11.1; 70 7.75,-11.1; 71 8.25,-11.1; 72 8.75,-11.1; 109 8.75,11.1; 110 8.25,11.1; 111 7.75,11.1; 112 7.25,11.1; 113 6.75,11.1; 114 6.25,11.1; 115 5.75,11.1; 116 5.25,11.1; 117 4.75,11.1; 118 4.25,11.1; 119 3.75,11.1; 120 3.25,11.1; 121 2.75,11.1; 122 2.25,11.1; 123 1.75,11.1; 124 1.25,11.1; 125 0.75,11.1; 126 0.25,11.1; 127 -0.25,11.1; 128 -0.75,11.1; 129 -1.25,11.1; 130 -1.75,11.1; 131 -2.25,11.1; 132 -2.75,11.1; 133 -3.25,11.1; 134 -3.75,11.1; 135 -4.25,11.1; 136 -4.75,11.1; 137 -5.25,11.1; 138 -5.75,11.1; 139 -6.25,11.1; 140 -6.75,11.1; 141 -7.25,11.1; 142 -7.75,11.1; 143 -8.25,11.1; 144 -8.75,11.1
COCOON_48BIT = drill 0.8 octagon: 2V5W1@1 57.15,40.64; 2V5W1@2 64.77,27.94; 2V5W1@3 57.15,20.32; 2V5W1@4 64.77,7.62; 2V5W2@1 3.81,40.64; 2V5W2@2 3.81,20.32; 3V3W1@1 57.15,38.1; 3V3W1@2 64.77,30.48; 3V3W1@3 57.15,17.78; 3V3W1@4 64.77,10.16; 3V3W2@1 3.81,38.1; 3V3W2@2 3.81,17.78; A1@1 62.23,5.08; A1@2 6.35,43.18; A2@1 62.23,7.62; A2@2 6.35,40.64; A3@1 62.23,10.16; A3@2 6.35,38.1; A4@1 62.23,12.7; A4@2 6.35,35.56; A5@1 62.23,15.24; A5@2 6.35,33.02; A6@1 62.23,17.78; A6@2 6.35,30.48; A7@1 62.23,20.32; A7@2 6.35,27.94; A8@1 62.23,22.86; A8@2 6.35,25.4; A9@1 62.23,25.4; A9@2 6.35,22.86; A10@1 62.23,27.94; A10@2 6.35,20.32; A11@1 62.23,30.48; A11@2 6.35,17.78; A12@1 62.23,33.02; A12@2 6.35,15.24; A13@1 62.23,35.56; A13@2 6.35,12.7; A14@1 62.23,38.1; A14@2 6.35,10.16; A15@1 62.23,40.64; A15@2 6.35,7.62; A16@2 6.35,5.08; B1@1 59.69,43.18; B2@1 59.69,40.64; B3@1 59.69,38.1; B4@1 59.69,35.56; B5@1 59.69,33.02; B6@1 59.69,30.48; B7@1 59.69,27.94; B8@1 59.69,25.4; B9@1 59.69,22.86; B10@1 59.69,20.32; B11@1 59.69,17.78; B12@1 59.69,15.24; B13@1 59.69,12.7; B14@1 59.69,10.16; B15@1 59.69,7.62; B16@1 59.69,5.08; GNDW1@1 57.15,43.18; GNDW1@2 64.77,25.4; GNDW1@3 57.15,22.86; GNDW1@4 64.77,5.08; GNDW2@1 3.81,43.18; GNDW2@2 3.81,22.86; JTAG_GND 50.8,48.26; JTAG_TCK 48.26,48.26; JTAG_TDI 43.18,48.26; JTAG_TDO 45.72,48.26; JTAG_TMS 40.64,48.26; VIW1@1 57.15,35.56; VIW1@2 64.77,33.02; VIW1@3 57.15,15.24; VIW1@4 64.77,12.7; VIW2@1 3.81,35.56; VIW2@2 3.81,15.24 | drill 0.8 round: A16@1 62.23,43.18 | drill 0.8 square: JTAG_REF 53.34,48.26 | hole 3.048: 2.032,31.496; 2.032,11.176; 55.372,11.176; 66.548,16.764; 55.372,31.496; 66.548,37.084
32005-201 = smd 3.1 x 0.5: 1 3,1.6; 2 3,0.8; 3 3,0; 4 3,-0.8; 5 3,-1.6 | smd 2.5 x 2: M1 -3,-4.45; M2 -3,4.45 | smd 3.3 x 2: M3 2.9,4.45; M4 2.9,-4.45 | hole 0.9: 0,2.2; 0,-2.2
HC49/S = drill 0.813 round: 1 -2.413,0; 2 2.413,0

### Placement (x,y rotation side)
C3  60.72,81.49 180 top
C4  49.53,80.64 270 top
C5  43.18,80.14 0 top
C6  66.09,76.16 90 top
C7  55.63,74.93 270 top
C9  33.23,71.72 90 top
C11  57.78,70.23 90 top
C12  66.09,69.16 270 top
C15  31.75,57.4 90 top
C16  38.86,54.61 0 top
C17  23.62,54.61 90 top
C18  40.64,28.83 270 top
C19  47.27,40.03 0 top
C21  48.59,38.02 0 top
C22  13.72,33.02 270 top
C23  35.92,26.04 270 top
C24  30.1,57.4 90 top
C25  44.07,32.26 270 top
C26  30.23,26.8 270 top
C27  41.61,51.99 180 top
C28  22.23,26.42 270 top
C29  14.48,38.86 180 top
C30  22.23,1.93 180 top
C31  14.48,40.39 180 top
C48  14.48,74.42 0 top
C49  10.16,80.9 180 top
C50  10.67,74.42 180 top
IC1  30.48,12.7 270 top
JP1  STAND-OFF  [STAND-OFF]  2.54,2.54 0 top
JP2  66.04,2.54 0 top
JP3  66.04,82.55 0 top
JP4  48.26,22.86 270 top
JP5  2.54,82.55 0 top
L1  16.51,80.01 0 top
L2  6.35,76.2 0 top
LED1  17.53,65.53 270 top
OSC  14.12,53.44 0 top
PWR  22.86,76.2 270 top
PWRIN  22.86,81.28 180 top
PWRSELECT  36.96,68.58 90 top
R1  55.2,83.02 180 top
R2  43.18,82.04 0 top
R3  47.62,80.64 270 top
R4  51.44,80.64 270 top
R5  22.86,73.91 0 top
R6  43.18,78.23 0 top
R7  57.78,74.93 90 top
R8  41.91,71.75 180 top
R10  41.91,69.85 180 top
R11  41.91,67.94 180 top
R12  57.78,66.04 0 top
R13  57.78,64.14 0 top
R14  14.61,72.52 0 top
R15  14.1,70.87 0 top
R16  10.54,72.52 180 top
R17  10.92,70.87 180 top
R33  48.13,19.81 0 top
R37  17.53,63.25 0 top
RX  61.59,66.04 90 top
SW1  49.53,15.24 180 top
TX  61.59,64.14 90 top
U1  55.65,80.08 270 top
U3  49.21,72.16 180 top
U5  11.43,77.47 90 top
U7  46.1,49.66 0 top
U8  29.97,40.64 90 top
U$1  0,16.51 0 top
U$3  [GADGETFACTORY_LOGO]  17.27,13.97 0 top
U$4  [LX9_SIZE]  12.83,11.81 0 top
USB  33.02,78.87 270 top
X1  62.15,72.66 270 top

### Tracks (layer width: path | path; a pad name or v marks a point on that pad's centre or on a via)
1V2  (via drill 0.38)
  Top 0.203: 24.37,39.89 U8.128 16.52,39.89 16.51,39.88 16,40.39 C31.1 | 35.69,39.37 35.71,39.39 U8.52 45.7,39.39 46.48,38.61 47.03,38.61 47.61,38.02 C21.1 | U8.28 34.72,34.49 34.67,34.54 | U8.19 30.22,34.41 30.23,34.42 | C15.1 31.75,56.64 31.5,56.64 31.5,55.63 30.72,54.85 U8.89 30.72,46.75 30.73,46.74
  Top 0.254: C26.1 U8.19
  Top 0.61: L2.2 7.03,74.42 C50.2 9.74,74.35 R16.2 | v7.24,71.88 7.24,65.15 v7.62,64.77 | v24.51,44.7 25.02,44.7
  Top 1.016: R16.2 8.89,72.52 8.51,72.9 v8.26,72.9 v7.24,72.9 v7.24,71.88 v8.26,71.88
  Bottom 0.61: v7.62,64.77 7.62,61.59 v24.51,44.7
  Bottom 1.016: v7.24,71.88 v8.26,71.88 v8.26,72.9 v7.24,72.9 v7.24,71.88
  pour Top (rank 2): 23.62,46.99 36.32,46.99 36.32,34.29 23.62,34.29
3V3  (via drill 0.38)
  Top 0.203: C29.1 17.02,38.86 17.55,39.39 U8.129 20.81,39.39 21.08,39.12 | U8.53 46.33,39.89 C19.1 | U8.76 37.22,53.77 C16.1 | C27.1 43.42,53.01 U7.8 44.2,51.82 v43.69,51.31 | U7.3 v46.74,48.01 | v53.34,67.56 53.34,67.82 | U8.122 20.79,42.89 20.83,42.93 | U8.125 22.11,41.39 v22.61,40.89 | v22.61,38.1 20.9,36.39 U8.135 17.85,36.39 17.27,35.81 14.99,35.81 13.72,34.54 C22.1 | U8.103 23.72,50.14 v23.37,49.78 | U8.86 32.22,48.22 v32,48.01 | U8.90 30.22,56.48 C24.1 | U8.4 22.72,27.71 C28.1 | U8.42 43.46,34.39 44.07,33.78 C25.1 | IC1.1 24.37,23.1 23.88,22.61 23.88,21.84 24.22,21.5 IC1.3 | U8.31 36.22,27.14 C23.1 | IC1.27 24.8,2.07 24.66,1.93 C30.1
  Top 0.254: U3.14 43.56,74.41 | U3.26 46.96,68.96 46.99,68.96 | U3.31 49.46,68.96 49.53,68.96 | U3.10 47.46,75.53 47.37,75.44 | U7.8 U7.7 | U8.103 23.72,53.71 C17.1 | U8.122 18.84,42.93 | U8.4 22.72,30.72 22.86,30.86 | U8.18 29.72,31.24 | U8.20 30.72,31.74 v31.24,32.26 | v28.96,32.26 28.96,32.51 | v36.32,32.26 36.32,32.77 | U8.31 36.22,31.14 36.32,31.24 | U8.42 38.71,34.39 v38.61,34.29 | U8.53 40.91,39.89 40.89,39.88 38.1,39.88 v37.85,40.13 | v37.85,38.35 37.85,38.1 | U8.63 39.56,44.89 39.37,44.7 | U8.69 39.99,47.89 39.37,48.51 | U8.76 37.22,50.66 37.59,50.29 | U8.90 30.22,49.27 29.97,49.02 | U5.9 v10.79,76.96
  Top 0.406: v63.5,35.56 63.5,27.94 U$1.3V3W1@4 63.5,25.4 v63.5,22.86 | v63.5,53.34 63.5,48.26 U$1.3V3W1@2
  Top 0.61: v13.46,60.96 12.95,60.96 | R14.2 15.48,72.59 C48.2 16.38,74.42 16.38,78.78 L1.2
  Top 1.016: 15.48,72.59 16.44,72.59 v17.02,72.01 v18.03,72.01 v18.03,73.03 v17.02,73.03
  Bottom 0.203: v46.74,48.01 46.74,50.55 45.97,51.31 v43.69,51.31 | U$1.JTAG_REF v53.34,67.56 | v28.25,12.9 26.92,14.22 24.38,14.22 23.62,14.99 23.62,16.61 v23.72,16.71
  Bottom 0.254: 38.35,34.29 v38.61,34.29 | v10.79,76.96 12.06,75.69 17.02,75.69 v17.02,73.03
  Bottom 0.406: v63.5,53.34 58.42,53.34 U$1.3V3W1@1 | v63.5,35.56 58.42,35.56 U$1.3V3W1@3 | v28.96,32.26 v31.24,32.26 v36.32,32.26 38.35,34.29 | v37.85,38.35 v37.85,40.13 | v22.61,38.1 v22.61,40.89 | v29.72,48.01 v32,48.01
  Bottom 0.61: v13.46,60.96 23.37,51.05 v23.37,49.78 v23.37,48.13
  Bottom 1.016: v39.62,74.68 v39.62,75.56 v39.62,82.8 v39.62,83.69 | v17.02,73.03 v18.03,73.03 v18.03,72.01 v17.02,72.01 v17.02,73.03
  pour Top (isolate 0.254, rank 3): 0,85.09 0,0 68.58,0 68.58,85.09
3V3OUT_A
  Top 0.254: U3.6 49.46,77.41 49.02,77.85 46.99,77.85 46.23,78.61 46.23,79.12 45.21,80.14 C5.2
5V  (via drill 0.38)
  Top 0.203: R5.2 23.86,68.34 24,68.2
  Top 0.254: 57.83,71.28 arc90 C11.2 57.11,71.91 U3.42 50.96,71.91 U3.3 50.96,77.22 50.46,77.22 | R7.2 arc90 57.81,75.9 v59.22,75.9 | 59.74,81.47 C3.2 59.26,81.03 U1.6 56.95,82.88 56.9,82.93 56.28,82.93 R1.1 | 50.46,77.22 U3.4 | 50.46,77.22 50.46,78.7 50.04,79.12 50.04,79.14 C4.2 | U5.7 8.52,77.97 8.38,78.11 8.38,80.12 C49.2 | U5.3 14.48,77.47 v14.73,77.22 14.49,76.97 U5.2
  Top 0.406: U$1.VIW2@2 2.54,33.02 2.54,40.64 4.32,42.42 4.32,50.8 3.81,51.31 U$1.VIW2@1 2.16,52.07 v2.16,61.34 | U$1.VIW1@4 64.77,30.61 64.39,30.99 64.39,35.18 67.31,38.1 67.31,48.26 66.04,49.53 U$1.VIW1@2 64.77,52.32 64.39,52.7 v64.39,66.42 | v59.22,71.28 57.83,71.28 | v59.74,80.11 59.74,81.47 | v15.49,68.07 19.43,68.07 19.68,68.33
  Top 1.016: PWRSELECT.2 35.18,68.58 35.18,67.82 31.11,67.82 30.73,68.2 24,68.2 19.81,68.2 19.68,68.33 19.68,82.8 6.99,82.8 6.99,81.41 6.86,81.28 | C49.2 8,80.9 v7.62,81.28 | v7.62,81.28 v7.62,80.26 v6.6,80.26 v6.6,81.28 6.86,81.28 | 6.86,81.28 v7.62,81.28
  Bottom 0.254: v59.22,71.28 59.22,71.23
  Bottom 0.406: U$1.VIW1@1 58.42,50.8 64.77,50.8 U$1.VIW1@2 | U$1.VIW1@4 63.5,30.48 58.42,30.48 U$1.VIW1@3 | v59.22,71.28 v59.22,75.9 59.22,80.11 v59.74,80.11 | 59.22,71.23 C11.2 | v64.39,66.42 64.39,70.74 63.37,71.75 59.7,71.75 v59.22,71.28 | v2.16,61.34 2.16,68.07 v15.49,68.07 | PWRSELECT.2 48.39,68.58 48.39,72.14 59.22,72.14 v59.22,71.28
  Bottom 1.016: v6.6,80.26 7.11,79.76 7.11,79.25 14.73,79.25 v14.73,77.22 | v6.6,80.26 v6.6,81.28 v7.62,81.28 v7.62,80.26 v6.6,80.26
!CAS
  Top 0.203: U8.5 23.22,24.75 21.08,22.61 21.08,12.06 22.85,10.3 IC1.17
!RAS
  Top 0.203: U8.2 21.72,28.33 20.57,27.18 20.57,11.68 22.76,9.5 IC1.18
!WE
  Top 0.203: U8.6 23.72,24.61 21.59,22.48 21.59,12.32 22.81,11.1 IC1.16
A0
  Top 0.203: U8.140 17.13,33.89 16.26,33.02 16.26,10.03 20.79,5.5 IC1.23
A1
  Top 0.203: U8.139 16.86,34.39 15.75,33.27 15.75,9.4 20.45,4.7 IC1.24
A2
  Top 0.203: U8.138 16.6,34.89 15.24,33.53 15.24,8.89 20.23,3.9 IC1.25
A3
  Top 0.203: U8.137 16.34,35.39 14.73,33.78 14.73,8 19.63,3.1 IC1.26
A4
  Top 0.203: U8.46 44.38,36.39 46.48,34.29 46.48,27.3 43.43,24.26 43.43,5.59 40.95,3.1 IC1.29
A5
  Top 0.203: U8.45 42.34,35.89 42.42,35.81 44.2,35.81 45.97,34.04 45.97,27.43 42.93,24.38 42.93,6.6 40.22,3.9 IC1.30
A6
  Top 0.203: U8.44 42.59,35.39 42.67,35.31 43.94,35.31 45.47,33.78 45.47,27.56 42.42,24.51 42.42,7.11 40.01,4.7 IC1.31
A7
  Top 0.203: U8.43 43.6,34.89 44.96,33.53 44.96,27.69 41.91,24.64 41.91,8.38 39.03,5.5 IC1.32
A8
  Top 0.203: U8.41 42.31,33.89 43.18,33.02 43.18,26.54 41.4,24.77 41.4,9.14 38.56,6.3 IC1.33
A9
  Top 0.203: U8.40 42.17,33.39 42.67,32.89 42.67,26.8 40.89,25.02 40.89,9.91 38.09,7.1 IC1.34
A10
  Top 0.203: U8.141 17.39,33.39 16.76,32.77 16.76,10.41 20.88,6.3 IC1.22
A11
  Top 0.203: U8.35 38.22,28.58 39.88,26.92 39.88,10.16 37.62,7.9 IC1.35
A12
  Top 0.203: U8.34 37.72,28.32 39.37,26.67 39.37,10.41 37.66,8.7 IC1.36
BA0
  Top 0.203: U8.143 17.91,32.39 17.78,32.26 17.78,11.43 21.31,7.9 IC1.20
BA1
  Top 0.203: U8.142 17.65,32.89 17.27,32.51 17.27,10.92 21.09,7.1 IC1.21
CKE
  Top 0.203: U8.33 37.22,28.06 38.86,26.42 38.86,10.92 37.44,9.5 IC1.37
CLK
  Top 0.203: U8.32 36.72,27.79 38.35,26.16 38.35,11.43 37.22,10.3 IC1.38
CS
  Top 0.203: U8.1 21.22,28.59 20.07,27.43 20.07,11.05 22.41,8.7 IC1.19
D+
  Top 0.254: R2.1 40.77,82.04 38.73,80.01 34.04,80.01 33.02,78.99 USB.3
D-
  Top 0.254: USB.2 33.82,77.64 34.16,77.98 36.2,77.98 36.45,78.23 R6.1
DO_A
  Top 0.254: U1.1 53.95,81.03 53.95,81.79 | R4.1 53.8,81.64 53.95,81.79 | 53.95,81.79 53.95,82.76 R1.2
DQ0
  Top 0.203: U8.9 25.22,25.2 25.78,24.64 25.78,22.61 25.48,22.3 IC1.2
DQ1
  Top 0.203: U8.10 25.72,25.46 26.29,24.89 26.29,21.21 25.78,20.7 IC1.4
DQ2
  Top 0.203: U8.11 26.22,25.72 26.8,25.15 26.8,20.32 26.38,19.9 IC1.5
DQ3
  Top 0.203: U8.12 26.72,25.98 27.3,25.4 27.3,19.18 26.43,18.3 IC1.7
DQ4
  Top 0.203: IC1.8 26.77,17.5 27.72,18.45 U8.14
DQ5
  Top 0.203: IC1.10 26.82,15.9 28.22,17.3 U8.15
DQ6
  Top 0.203: IC1.11 27.55,15.1 28.72,16.28 U8.16
DQ7
  Top 0.203: U8.8 24.72,24.21 22.61,22.1 22.61,14.73 23.84,13.5 IC1.13
DQ8
  Top 0.203: IC1.42 32.98,13.5 31.22,15.26 U8.21
DQ9
  Top 0.203: IC1.44 33.41,15.1 31.72,16.79 U8.22
DQ10
  Top 0.203: IC1.45 33.88,15.9 32.22,17.56 U8.23
DQ11
  Top 0.203: IC1.47 34.32,17.5 32.72,19.09 U8.24
DQ12
  Top 0.203: U8.26 33.72,28.39 33.27,27.94 33.27,19.56 34.53,18.3 IC1.48
DQ13
  Top 0.203: U8.27 34.22,28.13 33.78,27.69 33.78,20.57 34.46,19.9 IC1.50
DQ14
  Top 0.203: U8.29 35.22,28.49 34.29,27.56 34.29,21.84 35.43,20.7 IC1.51
DQ15
  Top 0.203: U8.30 35.72,28.36 34.8,27.43 34.8,22.86 35.36,22.3 IC1.53
DQMH
  Top 0.203: U8.17 29.22,24.37 30.73,22.86 30.73,13.97 33.6,11.1 IC1.39
DQML
  Top 0.203: IC1.15 22.9,11.9 22.1,12.7 22.1,22.35 24.22,24.48 U8.7
EECS_A
  Top 0.254: U3.48 53.46,75.06 52.96,75.56 52.96,76.83 53.59,77.47 57.15,77.47 58.42,78.74 58.42,79.63 57.91,80.14 57,80.14 U1.5
EEDATA_A
  Top 0.254: 51.46,79.13 51.46,79.64 R4.2 | 51.46,79.13 U1.3 | U3.2 51.46,79.13
EESK
  Top 0.254: U3.1 51.96,77.49 52.7,78.23 55.03,78.23 55.03,78.27 55.88,79.12 56.94,79.12 U1.4
FB_1V2
  Top 0.203: U5.10 9.89,76.47 10.67,75.69 10.67,73.28 11.34,72.61 R16.1 11.34,71.79 11.3,71.75 10.41,71.75 10.29,71.63 10.29,71.03 R17.2
FB_3V3
  Top 0.203: U5.1 14.21,76.47 14.48,76.2 14.48,73.19 R14.1 14.22,72.1 14.22,71.75 14.9,71.08 R15.2
FILTERED_VCC_A
  Top 0.2: C7.2 R7.1
  Top 0.254: U3.46 55.6,73.91 C7.2
FLASH_CS  (via drill 0.38)
  Top 0.203: v37.34,36.07 37.34,33.53 38.48,32.39 U8.38 | U7.1 43.99,46.28 v42.93,45.21
  Bottom 0.203: v42.93,45.21 42.67,45.21 41.91,44.45 36.83,44.45 35.56,43.18 35.56,37.85 v37.34,36.07
FLASH_SCK
  Top 0.203: U7.6 46.74,51.82 46.23,51.31 44.96,51.31 43.94,50.29 43.18,50.29 42.42,49.53 42.42,48.77 42.04,48.39 U8.70
FLASH_SI  (via drill 0.38)
  Top 0.203: U7.5 48.01,50.29 47.5,49.78 v45.21,49.78 | U8.64 38.18,45.39 37.85,45.72 37.85,47.75 v38.35,48.26
  Bottom 0.203: v38.35,48.26 39.88,49.78 v45.21,49.78
FLASH_SO
  Top 0.203: U7.2 45.47,47.75 45.21,48.01 43.43,48.01 42.93,47.5 42.93,46.74 42.08,45.89 U8.65
GND  (via drill 0.38)
  Top 0.2: v47.96,74.59 U3.9 | U3.18 v46.27,72.41 | v52.16,73.41 U3.45 | v52.16,74.41 U3.47
  Top 0.203: U8.113 20.05,47.39 v20.57,46.86 | v21.46,50.16 21.22,50.41 U8.108 21.22,52.95 20.83,53.34 19.3,53.34 OSC.2@2 | U8.96 27.22,50.08 v27.18,50.04 | U8.91 29.72,50.04 v29.46,49.78 | U8.77 36.72,50.06 v36.7,50.04 | U8.73 38.72,50.15 v38.61,50.04 | U8.68 39.52,47.39 v39.37,47.24 | U8.60 39.41,43.39 v39.37,43.43 | U8.49 39.41,37.89 v39.37,37.85 | U8.25 33.22,31.19 v33.27,31.24 | U8.13 27.22,31.2 v27.18,31.24 | U8.144 20.46,31.89 v20.57,32 | U8.136 20.5,35.89 v21.08,35.31 | v44.07,30.23 C25.2 | C22.2 v13.72,30.73 | C27.2 40.8,50.89 v40.89,50.8 | U7.4 v48.01,48.01 | v50.96,69.47 U3.34 | U8.130 20.04,38.89 v20.83,38.1 | U8.54 39.62,40.39 v39.12,40.89 | C19.2 48.51,40.03 v49.28,39.27 | C21.2 50.06,38.02 v50.77,37.31 | SW1.B' SW1.B v55.16,13.24 v55.17,13.23 | U8.3 v22.22,31.49 v22.23,31.5 | R15.1 13.3,71.28 v12.57,72.01 11.72,71.16 R17.1 | IC1.28 34.78,2.3 v34.29,2.79 | IC1.41 34.54,12.7 v34.29,12.45 | IC1.46 34.35,16.7 v34.29,16.76 | IC1.12 26.09,14.3 26.42,13.97 26.42,13.21 v26.67,12.95 | IC1.6 26.14,19.1 v26.19,19.15 | C23.2 35.92,24.23 v36.17,23.98 | IC1.54 36.16,23.97 v36.17,23.98 | IC1.52 36.94,21.5 37.03,21.59 37.03,23.77 36.83,23.98 v36.17,23.98 | C30.2 20.04,1.93 v19.99,1.88 | LED1.C v19.81,65.53
  Top 0.25: C12.1 v66.09,71.49 | C6.1 v66.09,73.83
  Top 0.254: C7.1 55.63,75.95 54.48,75.95 | 54.48,75.95 v54.1,75.95 | C11.1 57.78,69.34 v59.18,69.34 | U1.2 53.09,80.08 v53.09,80.01 | v61.71,80.09 C3.1 | C5.1 41.53,80.14 v40.89,79.5 | C4.1 49.53,82.17 v48.64,83.06 | U3.25 46.46,67.16 v46.1,66.8 | U3.47 54.48,74.41 54.48,75.95 | v30.23,24.64 C26.2 | C28.2 22.23,25.02 v21.59,24.38 | v40.64,26.67 C18.2 | C16.2 v40.89,54.61 | C15.2 v31.75,59.44 | C24.2 30.1,58.8 v30.73,59.44 | C17.2 v23.62,56.64 | C29.2 12.7,38.86 v12.45,38.61 | C31.2 13.21,40.39 v12.45,39.62 | U5.6 10.27,78.47 11.16,79.36 | 11.16,79.36 C49.1 | 12.05,78.47 U5.5 | 12.05,78.47 11.16,79.36 | C50.1 11.67,78.09 12.05,78.47 | PWR.C 23.91,78.96 PWRIN.2
  Top 0.406: C9.1 33.21,70.74 31.42,70.74 USB.5 | v49.91,70.99 v49.91,73.28
  Top 0.61: 12.57,74.42 C50.1 | 12.57,74.42 C48.1 | v12.57,72.01 12.57,74.42
  Top 1.016: C9.1 33.23,69.89 v33.73,69.39 | v32.73,69.39 32.73,69.43 33.15,69.85 | PWRIN.2 25.53,80.01 25.65,79.88 v25.65,71.75 v25.65,70.87
  Bottom 0.203: v20.57,46.86 20.83,46.86 | v21.46,50.16 21.59,50.16 | v27.18,50.04 26.92,50.04 | v29.46,49.78 29.72,49.78 | v39.37,43.43 39.37,43.69 | v39.37,37.85 39.12,37.85 | v33.27,31.24 33.27,31.5 | v27.18,31.24 27.18,31.5 | v40.89,50.8 41.15,50.8 | v48.01,48.01 47.75,48.01 | U$1.JTAG_GND 50.8,69.3 v50.96,69.47 | v20.83,38.1 20.57,38.1 | v55.17,13.23 55.17,13.54 | v34.29,2.79 34.29,3.05 34.04,3.3 | v34.29,12.45 34.29,12.19 | v34.29,16.76 34.04,16.76 | v26.67,12.95 26.92,12.95 | v19.99,1.88 19.84,1.88 19.81,1.85 | v19.81,65.53 19.81,65.79
  Bottom 0.254: v59.18,69.34 59.18,69.72 | v40.89,54.61 41.15,54.61 | v31.75,59.44 32,59.44 | v30.73,59.44 30.48,59.44 | v12.45,38.61 12.7,38.61 | v12.45,39.62 12.7,39.62
  Bottom 1.016: v25.65,71.75 26.04,71.75 26.67,71.12 | v25.65,70.87 26.67,70.87
  other vias: 12.57,73.03
  pour Bottom (isolate 0.305, rank 3): 0,85.09 68.58,85.09 68.58,0 0,0
LED1
  Top 0.203: R37.2 18.53,62.21 15.49,59.18 15.49,49.78 17.39,47.89 U8.112
N$1
  Top 0.254: PWR.A 21.81,73.96 R5.1
N$2
  Top 0.254: RX.C R12.2
N$3
  Top 0.254: TX.C R13.2
N$4
  Top 0.254: U3.27 47.46,66.2 47.62,66.04 54.61,66.04 55.24,65.41 55.24,64.77 55.88,64.14 R13.1
N$5
  Top 0.254: U3.28 47.96,66.97 48.26,66.67 56.2,66.67 56.2,66.62 R12.1
N$7
  Top 0.203: LED1.A 16.48,63.3 R37.1
N$15_A
  Top 0.254: U3.5 49.96,77.93 49.4,78.49 48.01,78.49 47.62,78.87 R3.2
OSC_IN
  Top 0.203: OSC.3@3 19.2,57.3 17.78,55.88 17.78,51.82 19.3,50.29 20.07,50.29 21.34,49.02 27.69,49.02 28.22,49.56 U8.94
REBOOT  (via drill 0.38)
  Top 0.203: R33.1 46.13,18.81 SW1.A' SW1.A | v41.02,30.99 41.02,31.84 U8.37
  Top 0.254: R33.1 47.13,22.72 JP4.1
  Bottom 0.203: JP4.1 46.99,24.13 48.26,25.4 48.26,34.29 45.72,36.83 40.13,36.83 39.62,36.32 39.62,32.38 v41.02,30.99
SW_1V2
  Top 0.254: U5.8 6.52,77.47 L2.1
SW_3V3
  Top 0.254: U5.4 14.34,77.97 14.48,78.11 14.48,80.26 15.24,81.03 16.43,81.03 L1.1
TCK
  Top 0.203: R11.2 41.15,67.71 41.15,67.06 41.4,66.8 42.93,66.8 44.45,65.28 44.45,63.58 44.53,63.5 | U$1.JTAG_TCK 46.99,63.5 44.53,63.5 | 44.53,63.5 40.89,63.5 40.64,63.25 28.7,63.25 25.15,59.69 18.29,59.69 16.76,58.17 16.76,50.8 17.53,50.04 18.22,50.04 U8.109
TDI  (via drill 0.38)
  Top 0.203: v38.61,64.01 38.35,63.75 28.45,63.75 24.89,60.2 17.53,60.2 16.26,58.93 16.26,50.29 17.66,48.89 U8.110
  Top 0.254: R10.2 39.88,69.85 39.62,69.6 39.62,67.18 40.77,66.04 41.91,66.04 U$1.JTAG_TDI
  Bottom 0.203: v38.61,64.01 38.61,64.77 39.88,66.04 41.91,66.04 U$1.JTAG_TDI
TDO  (via drill 0.38)
  Top 0.203: 45.28,70.41 46.18,70.41 v46.23,70.36 | v39.12,73.15 36.07,73.15 v35.56,73.66 | v20.83,58.93 20.83,58.67 22.22,57.28 U8.106
  Top 0.254: U3.22 45.28,70.41 45.92,70.41 46.35,69.98 46.35,69.34 45.72,68.71 45.72,68.07 44.83,67.18 44.83,66.55 45.72,65.66 U$1.JTAG_TDO
  Bottom 0.203: v46.23,70.36 41.91,70.36 v39.12,73.15 | v35.56,73.66 24.38,73.66 20.83,70.1 v20.83,58.93
TMS  (via drill 0.38)
  Top 0.203: U8.107 21.72,54.99 v21.08,55.63
  Top 0.254: R8.2 39.75,71.75 38.99,70.99 38.99,66.8 40.64,65.15 U$1.JTAG_TMS
  Bottom 0.203: U$1.JTAG_TMS 40.64,64.52 39.12,62.99 26.16,62.99 21.08,57.91 v21.08,55.63
USB_RXD  (via drill 0.38)
  Top 0.203: U3.39 54.31,70.41 v54.61,70.1 | U8.105 22.72,58.28 v22.86,58.42
  Bottom 0.203: v54.61,70.1 54.61,63.25 53.85,62.48 26.92,62.48 v22.86,58.42
USB_TCK
  Top 0.254: U3.24 44.96,68.46 44.45,67.94 R11.1
USB_TDI
  Top 0.254: U3.23 42.97,69.91 R10.1
USB_TMS
  Top 0.254: U3.21 43.76,70.91 R8.1
USB_TXD  (via drill 0.38)
  Top 0.203: U3.40 55.33,70.91 v55.88,70.36 | U8.101 24.72,58.34 v24.38,58.67
  Bottom 0.203: v55.88,70.36 55.88,63.25 54.36,61.72 27.43,61.72 v24.38,58.67
USBDM_A
  Top 0.254: U3.8 48.46,77.14 48.26,77.34 46.23,77.34 45.34,78.23 R6.2
USBDP_A  (via drill 0.38)
  Top 0.254: U3.7 48.96,74.36 v49.02,74.3 | R3.1 47.61,81.66 | R3.1 47.51,81.53 | 46.1,81.64 R3.1 | v46.1,80.77 46.1,81.64 | R2.2 44.18,81.64 46.1,81.64
  Bottom 0.254: v49.02,74.3 49.02,80.77 v46.1,80.77
VBUS_A  (via drill 0.38)
  Top 0.406: 34.62,72.77 USB.1 | 34.62,72.77 34.54,72.77 | 34.62,72.77 v34.67,72.77 33.23,72.77 C9.2
  Bottom 0.406: 34.54,72.77 v34.67,72.77 34.8,72.77 34.8,66.04 PWRSELECT.1
VI
  Bottom 1.016: PWRSELECT.3 36.96,75.56 27.69,75.56 26.04,77.22 26.04,81.92 25.4,82.55 PWRIN.1
W1_A1
  Top 0.203: U$1.A1@1 61.21,21.59 59.69,23.11 53.85,23.11 51.05,25.91 51.05,34.54 50.29,35.31 48.77,35.31 48.01,36.07 46.23,36.07 44.91,37.39 U8.48
W1_A2
  Top 0.203: U$1.A2@1 61.21,24.13 60.2,25.15 57.4,25.15 56.64,24.38 54.1,24.38 52.07,26.42 52.07,35.05 50.8,36.32 49.28,36.32 48.51,37.08 46.74,37.08 44.93,38.89 U8.51
W1_A3
  Top 0.203: U$1.A3@1 60.96,27.94 58.67,27.94 56.13,25.4 54.61,25.4 53.09,26.92 53.09,30.23 53.59,30.73 53.59,35.05 53.09,35.56 53.09,37.34 48.51,41.91 45.72,41.91 45.2,41.39 U8.56
W1_A4
  Top 0.203: U8.58 43.15,42.39 43.69,42.93 49.02,42.93 54.1,37.85 54.1,36.07 54.61,35.56 54.61,33.78 55.63,32.77 55.63,31.75 57.15,30.23 61.21,30.23 U$1.A4@1
W1_A5
  Top 0.203: U$1.A5@1 62.23,32.26 61.47,32.26 60.45,33.27 56.64,33.27 55.63,34.29 55.63,36.07 55.12,36.58 55.12,38.35 49.58,43.89 U8.61
W1_A6  (via drill 0.38)
  Top 0.203: U$1.A6@1 60.96,35.56 59.18,35.56 58.42,36.32 58.42,37.34 57.66,38.1 56.9,38.1 55.88,39.12 55.88,40.13 v55.12,40.89 | U8.66 39.02,46.39 v38.86,46.23
  Bottom 0.203: v55.12,40.89 49.53,46.48 39.12,46.48 v38.86,46.23
W1_A7
  Top 0.203: U8.67 42.06,46.89 42.42,47.24 42.42,48.01 43.43,49.02 48.77,49.02 49.53,48.26 49.53,45.47 52.83,42.16 56.39,42.16 58.67,39.88 58.67,38.86 59.69,37.85 61.21,37.85 U$1.A7@1
W1_A8
  Top 0.203: U8.75 37.72,53.47 37.85,53.59 41.4,53.59 42.93,55.12 49.28,55.12 50.55,53.85 50.55,45.97 53.34,43.18 57.91,43.18 58.17,42.93 58.17,41.91 59.69,40.39 61.21,40.39 U$1.A8@1
W1_A9
  Top 0.203: U8.79 35.72,53.76 36.32,54.36 36.32,55.12 37.34,56.13 50.04,56.13 51.56,54.61 51.56,46.48 53.85,44.2 58.42,44.2 59.69,42.93 61.21,42.93 U$1.A9@1
W1_A10
  Top 0.203: U8.81 34.72,53.52 35.81,54.61 35.81,55.37 37.08,56.64 50.29,56.64 52.07,54.86 52.07,46.74 54.1,44.7 56.64,44.7 58.42,46.48 58.67,46.48 59.18,45.97 60.71,45.97 U$1.A10@1
W1_A11
  Top 0.203: U$1.A11@1 60.71,48.51 58.42,48.51 58.17,48.26 58.17,47.75 56.13,45.72 54.61,45.72 53.09,47.24 53.09,55.37 50.8,57.66 35.31,57.66 34.8,57.15 34.8,55.12 33.72,54.04 U8.83
W1_A12
  Top 0.203: U$1.A12@1 61.21,49.53 60.2,50.55 59.18,50.55 58.67,50.04 57.15,50.04 54.1,53.09 54.1,55.88 51.31,58.67 34.8,58.67 33.78,57.66 33.78,55.63 32.72,54.57 U8.85
W1_A13
  Top 0.203: U$1.A13@1 61.21,52.07 60.2,53.09 58.42,53.09 57.91,53.59 56.13,53.59 55.12,54.61 55.12,56.39 51.82,59.69 34.29,59.69 32.77,58.17 32.77,56.13 31.22,54.59 U8.88
W1_A14
  Top 0.203: U$1.A14@1 61.21,54.61 60.2,55.63 58.42,55.63 57.91,56.13 56.64,56.13 56.13,56.64 56.13,56.9 52.32,60.71 29.97,60.71 28.45,59.18 28.45,53.34 28.72,53.07 U8.93
W1_A15
  Top 0.203: U$1.A15@1 62.23,57.4 60.96,57.4 59.69,58.67 59.18,58.67 58.67,59.18 58.67,61.47 58.42,61.72 29.46,61.72 26.22,58.48 U8.98
W1_A16
  Top 0.203: U$1.A16@1 62.23,61.21 60.71,62.74 28.96,62.74 25.22,59 U8.100
W1_B1
  Top 0.203: U$1.B1@1 59.69,61.21 58.67,62.23 29.21,62.23 25.72,58.74 U8.99
W1_B2
  Top 0.203: U$1.B2@1 59.69,57.91 59.44,58.17 56.64,58.17 56.13,58.67 56.13,60.2 55.12,61.21 29.72,61.21 26.72,58.22 U8.97
W1_B3
  Top 0.203: U$1.B3@1 58.67,54.61 57.66,55.63 56.13,55.63 55.63,56.13 55.63,56.64 52.07,60.2 30.23,60.2 28.96,58.93 28.96,53.59 29.22,53.33 U8.92
W1_B4
  Top 0.203: U$1.B4@1 58.67,52.07 57.66,53.09 54.86,53.09 54.61,53.34 54.61,56.13 51.56,59.18 34.54,59.18 33.27,57.91 33.27,55.88 31.72,54.33 U8.87
W1_B5
  Top 0.203: U$1.B5@1 56.9,49.53 53.59,52.83 53.59,55.63 51.05,58.17 35.05,58.17 34.29,57.4 34.29,55.37 33.22,54.3 U8.84
W1_B6
  Top 0.203: U$1.B6@1 58.17,46.99 56.39,45.21 54.36,45.21 52.58,46.99 52.58,55.12 50.55,57.15 35.56,57.15 35.31,56.9 35.31,54.86 34.22,53.78 U8.82
W1_B7  (via drill 0.38)
  Top 0.203: U8.80 35.22,50.21 v34.54,49.53
  Bottom 0.203: U$1.B7@1 54.61,44.45 46.99,52.07 37.08,52.07 v34.54,49.53
W1_B8
  Top 0.203: U$1.B8@1 59.69,42.16 58.17,43.69 53.59,43.69 51.05,46.23 51.05,54.36 49.78,55.63 37.59,55.63 36.83,54.86 36.83,54.1 36.22,53.49 U8.78
W1_B9
  Top 0.203: U$1.B9@1 59.69,39.62 56.64,42.67 53.09,42.67 50.04,45.72 50.04,53.34 48.77,54.61 43.69,54.61 42.16,53.09 38.35,53.09 38.22,52.95 U8.74
W1_B10  (via drill 0.38)
  Top 0.203: U8.95 27.69,51.78 v27.69,53.34
  Bottom 0.203: U$1.B10@1 58.42,38.1 52.07,38.1 44.2,45.97 39.88,45.97 39.37,45.47 29.84,45.47 28.19,47.12 28.19,52.58 27.69,53.09 v27.69,53.34
W1_B11
  Top 0.203: U$1.B11@1 59.69,34.8 59.44,35.05 57.91,35.05 57.15,35.81 56.64,35.81 55.63,36.83 55.63,38.61 49.84,44.39 U8.62
W1_B12
  Top 0.203: U$1.B12@1 59.69,32.51 59.44,32.77 56.39,32.77 55.12,34.04 55.12,35.81 54.61,36.32 54.61,38.1 49.28,43.43 43.43,43.43 42.89,42.89 U8.59
W1_B13
  Top 0.203: U$1.B13@1 59.18,29.72 56.9,29.72 55.12,31.5 55.12,32.51 54.1,33.53 54.1,35.31 53.59,35.81 53.59,37.59 48.77,42.42 44.45,42.42 43.92,41.89 U8.57
W1_B14
  Top 0.203: U$1.B14@1 58.17,26.67 56.39,24.89 54.36,24.89 52.58,26.67 52.58,37.08 48.26,41.4 45.97,41.4 45.46,40.89 U8.55
W1_B15
  Top 0.203: U$1.B15@1 59.18,24.64 57.66,24.64 56.9,23.88 53.85,23.88 51.56,26.16 51.56,34.8 50.55,35.81 49.02,35.81 48.26,36.58 46.48,36.58 45.21,37.85 43.43,37.85 42.89,38.39 U8.50
W1_B16
  Top 0.203: U$1.B16@1 59.69,22.35 59.44,22.61 53.59,22.61 50.55,25.65 50.55,34.29 50.04,34.8 48.51,34.8 47.75,35.56 45.97,35.56 44.64,36.89 U8.47
W2_A1
  Top 0.203: U8.114 17.63,46.89 7.87,56.64 7.87,58.17 U$1.A1@2
W2_A2
  Top 0.203: U8.115 17.11,46.39 U$1.A2@2
W2_A3
  Top 0.203: U8.116 15.83,45.89 7.11,54.61 U$1.A3@2
W2_A4
  Top 0.203: U8.117 14.3,45.39 7.62,52.07 U$1.A4@2
W2_A5
  Top 0.203: U8.118 12.26,44.89 7.62,49.53 U$1.A5@2
W2_A6
  Top 0.203: U8.119 10.47,44.39 7.87,46.99 U$1.A6@2
W2_A7
  Top 0.203: U8.120 6.91,43.89 U$1.A7@2
W2_A8
  Top 0.203: U$1.A8@2 9.4,41.91 10.88,43.39 U8.121
W2_A9
  Top 0.203: U$1.A9@2 8.13,39.37 11.68,42.93 16.76,42.93 17.3,42.39 U8.123
W2_A10
  Top 0.203: U8.124 17.04,41.89 16.51,42.42 12.45,42.42 7.37,37.34 6.86,37.34 U$1.A10@2
W2_A11
  Top 0.203: U$1.A11@2 6.35,34.8 7.11,34.8 8.13,35.81 8.13,37.34 12.7,41.91 16.26,41.91 17.28,40.89 U8.126
W2_A12
  Top 0.203: U8.127 17.01,40.39 16,41.4 12.95,41.4 11.68,40.13 11.68,39.37 8.64,36.32 8.64,32.77 7.62,31.75 U$1.A12@2
W2_A13
  Top 0.203: U8.131 16.55,38.39 16,37.85 10.92,37.85 9.14,36.07 9.14,30.23 8.13,29.21 U$1.A13@2
W2_A14
  Top 0.203: U8.132 16.81,37.89 16.26,37.34 11.18,37.34 9.65,35.81 9.65,29.97 U$1.A14@2
W2_A15
  Top 0.203: U$1.A15@2 6.35,24.38 6.6,24.38 7.87,25.65 7.87,27.43 10.16,29.72 10.16,35.56 11.43,36.83 16.51,36.83 17.07,37.39 U8.133
W2_A16
  Top 0.203: U$1.A16@2 6.35,21.84 6.6,21.84 7.87,23.11 7.87,24.89 8.38,25.4 8.38,27.18 10.67,29.46 10.67,35.31 11.68,36.32 16.76,36.32 17.33,36.89 U8.134
XTIN_A
  Top 0.2: U3.43 61.2,72.41 62.15,71.46 X1.2
  Top 0.254: C12.2 62.65,68.16 62.23,68.58 62.23,70.17 X1.2
XTOUT_A
  Top 0.2: U3.44 61.2,72.91 62.15,73.86 X1.1
  Top 0.254: C6.2 63.19,77.16 62.23,76.2 62.23,75.15 X1.1

### Text on the board
tPlace: 5V | GND | Jack | USB | 6/28/2012 | Papilio Platform | Papilio Pro | www.GadgetFactory.net | BPC3011 V1.3 | Copyright 2009-2012 | Gadget Factory, LLC
tNames: Reset
Port0: PORTE | PORTA
Port1: PORTB | PORTF
Port2: PORTC
Port3: PORTD